# EAGLE board reveng-cpuonly-smdsock (EAGLE 6.4)
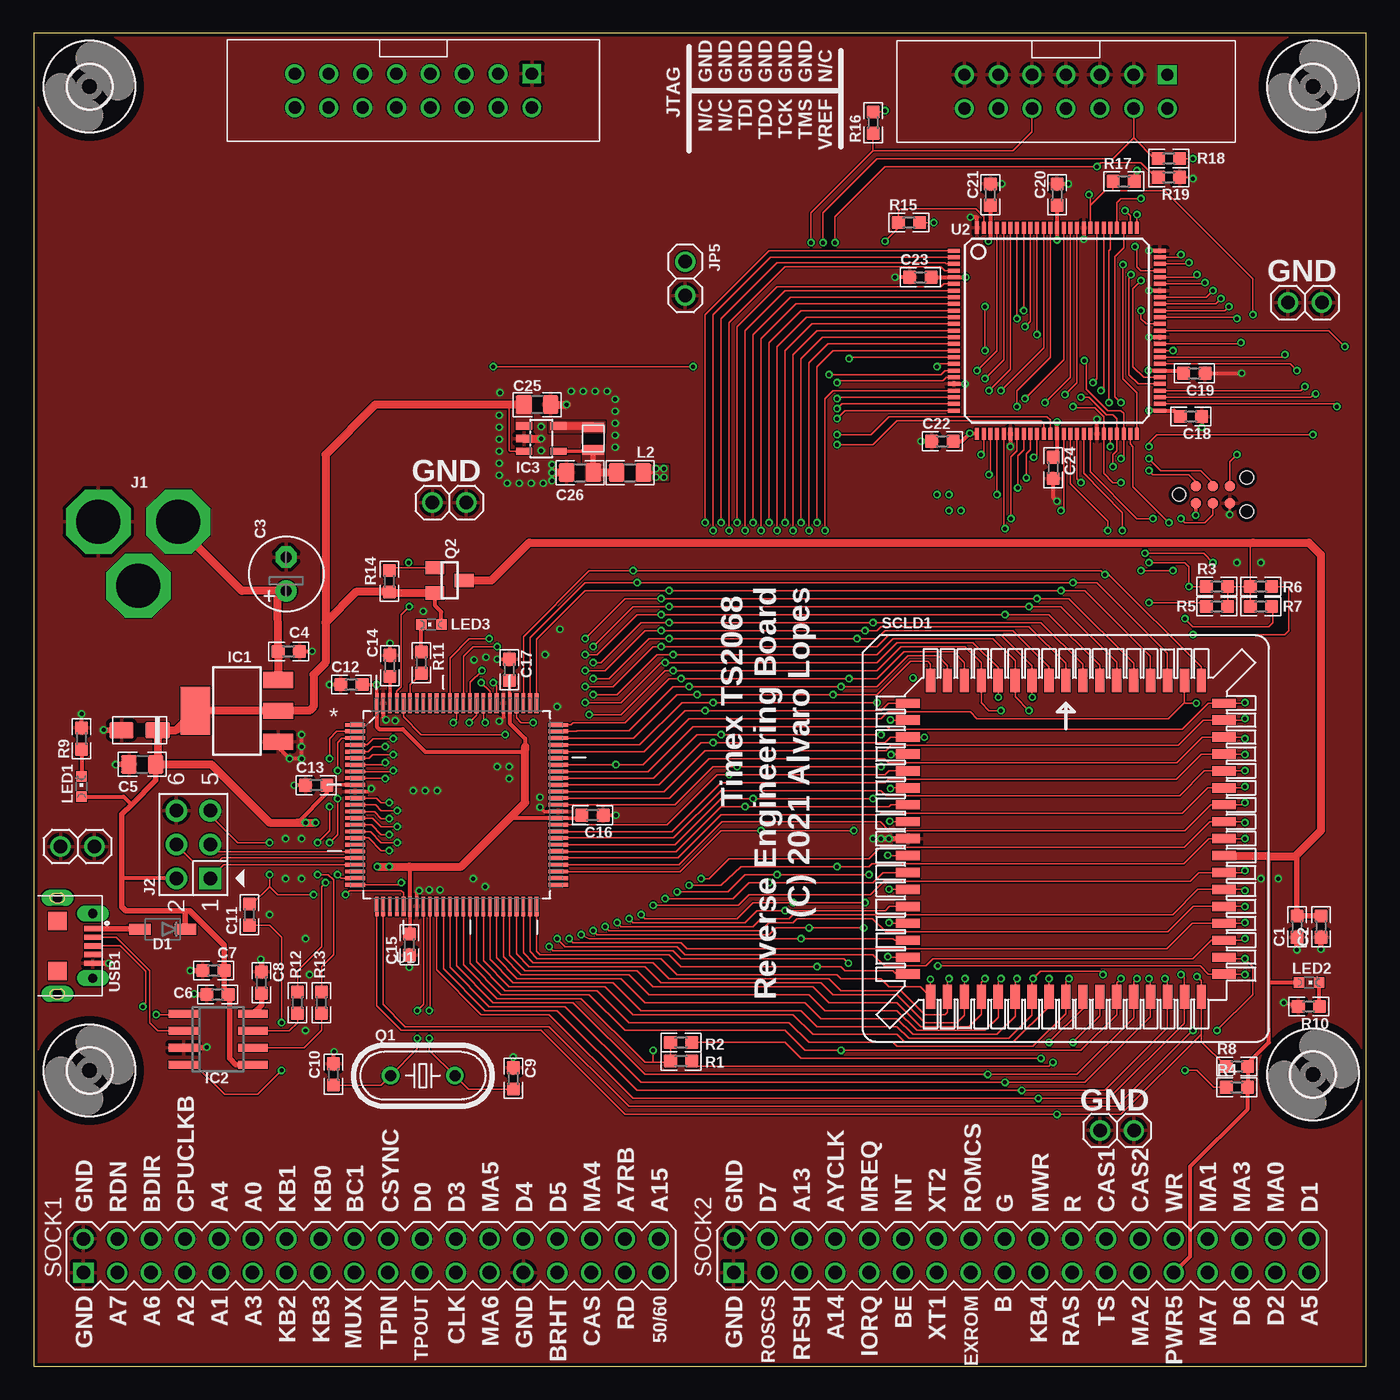
[diagram p2: board, top side]
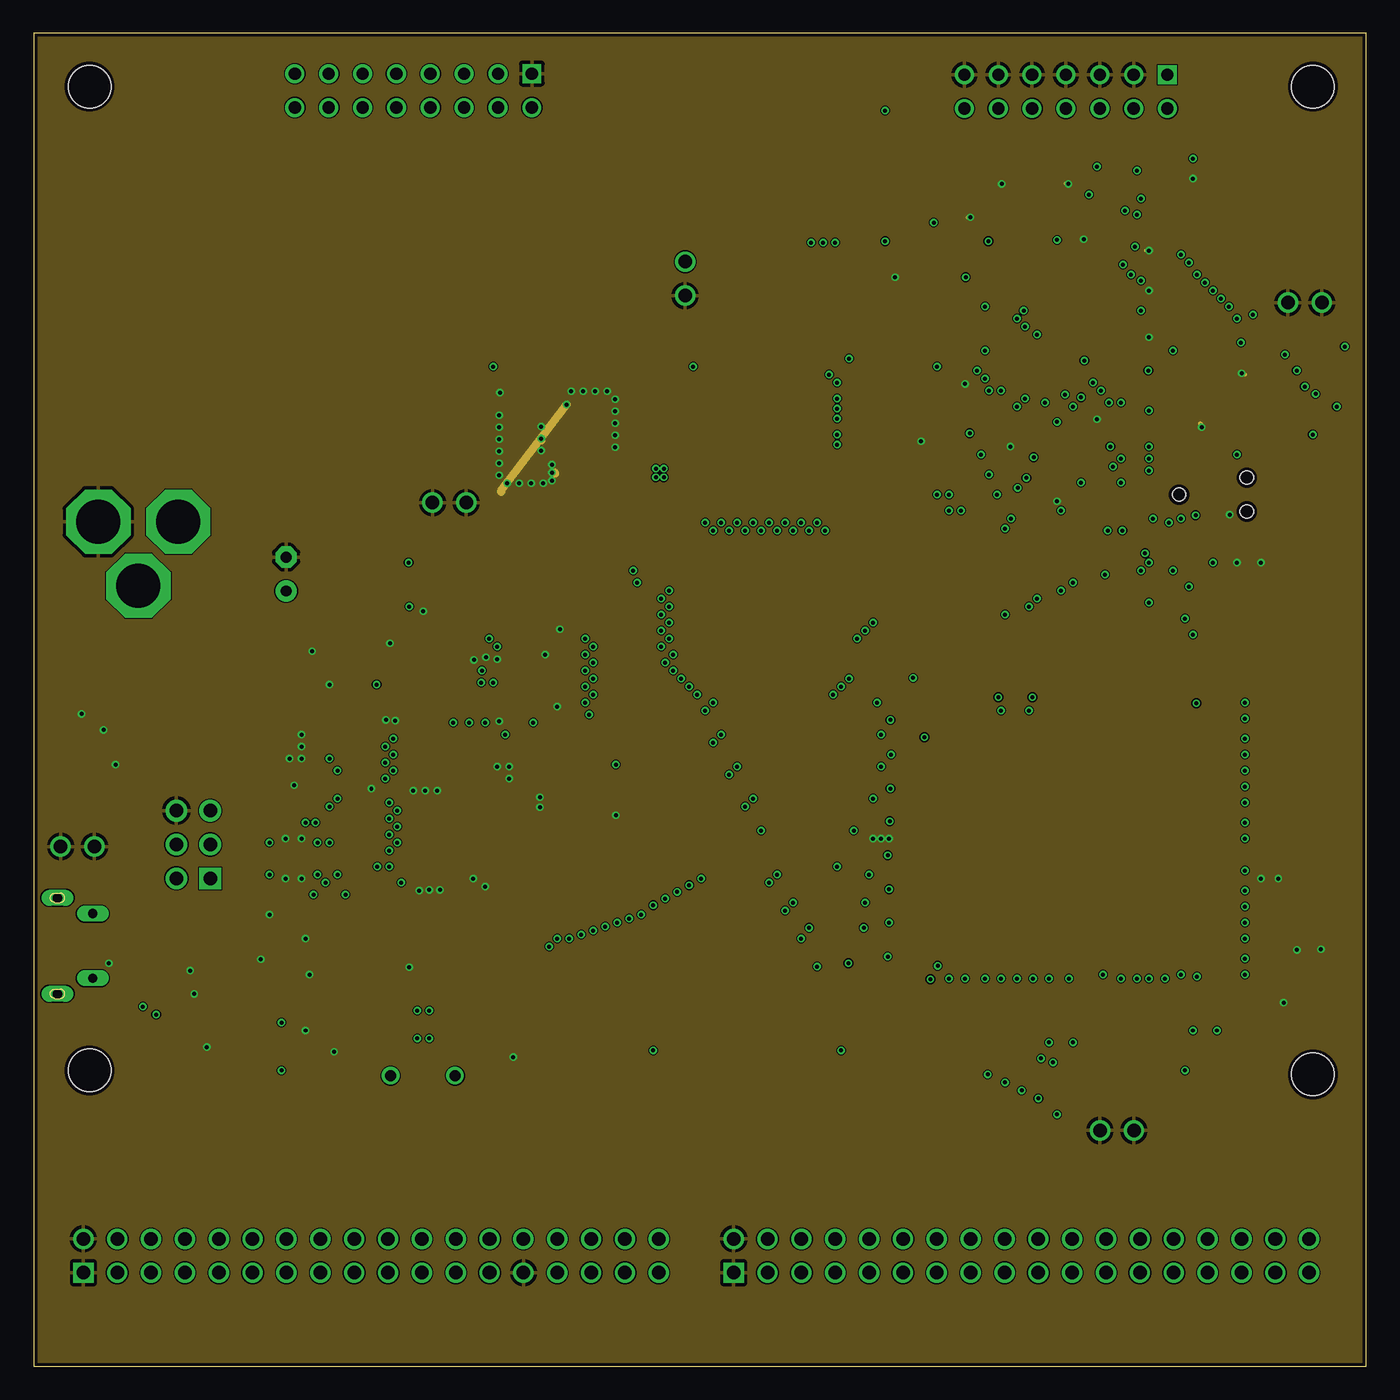
[diagram p3: board, inner layer Route2]
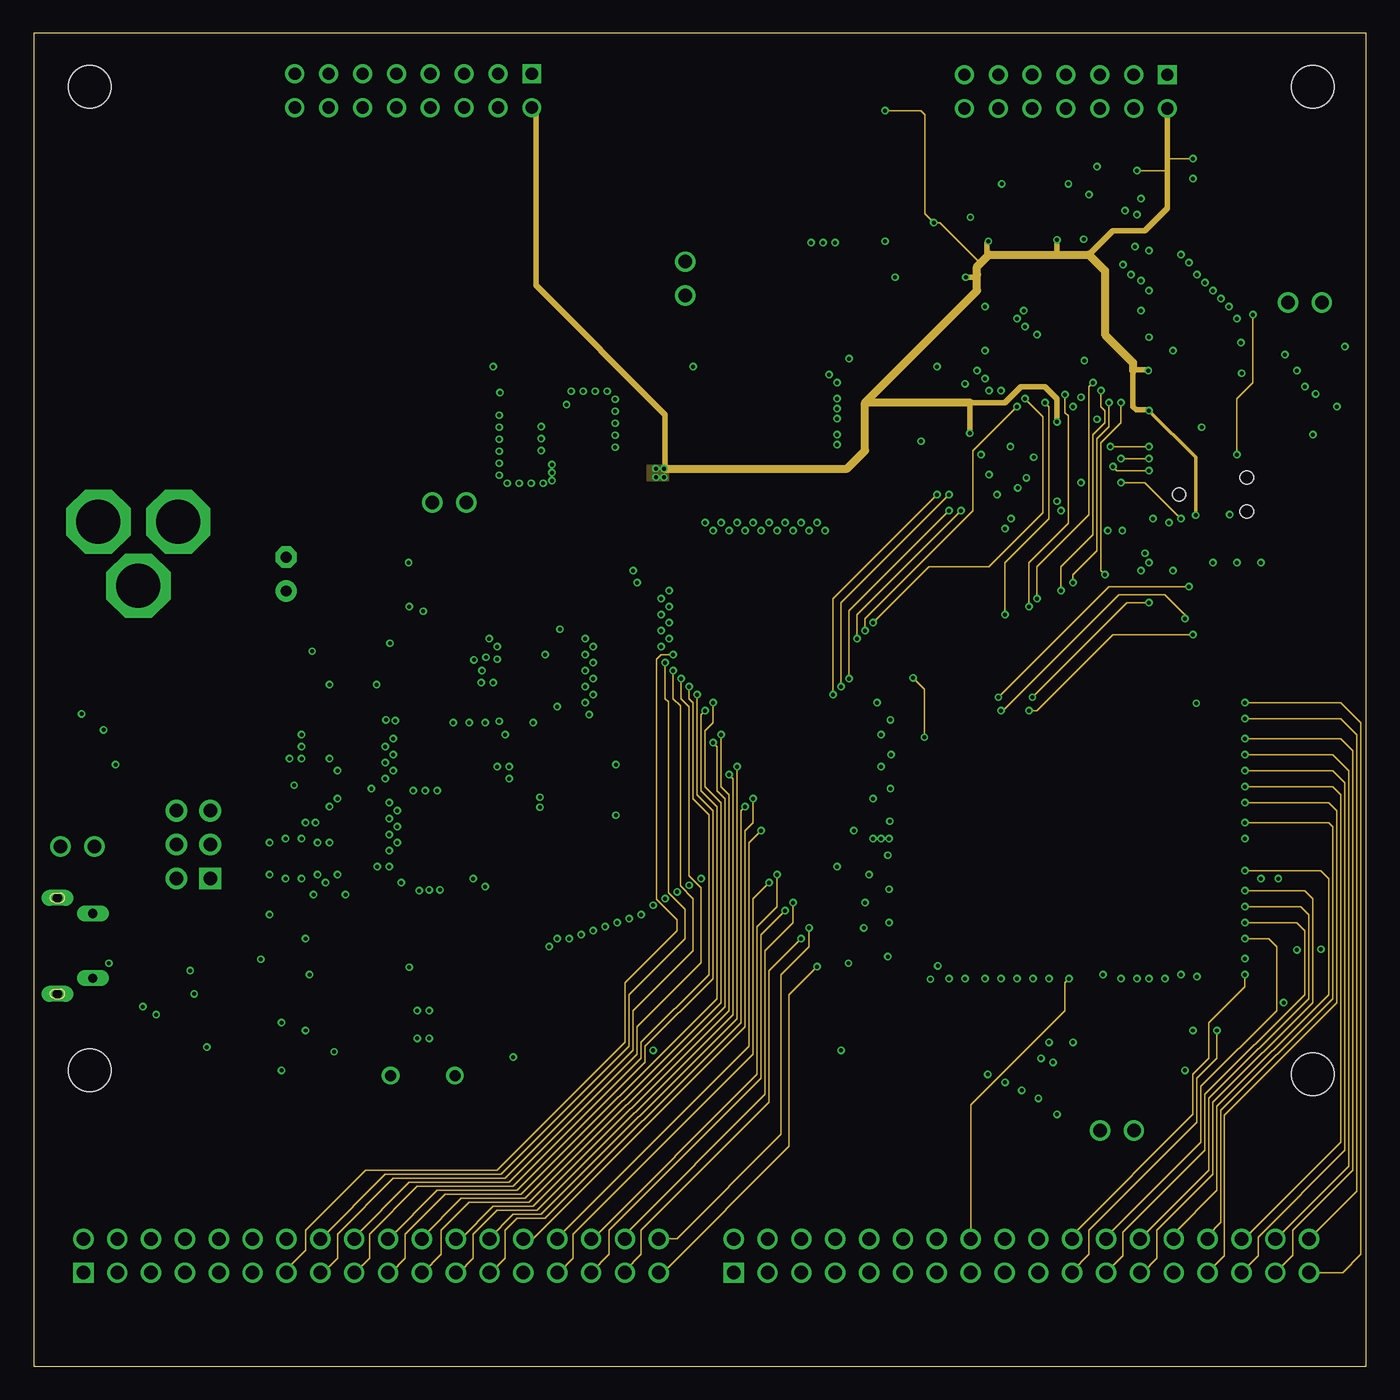
[diagram p4: board, inner layer Route15]
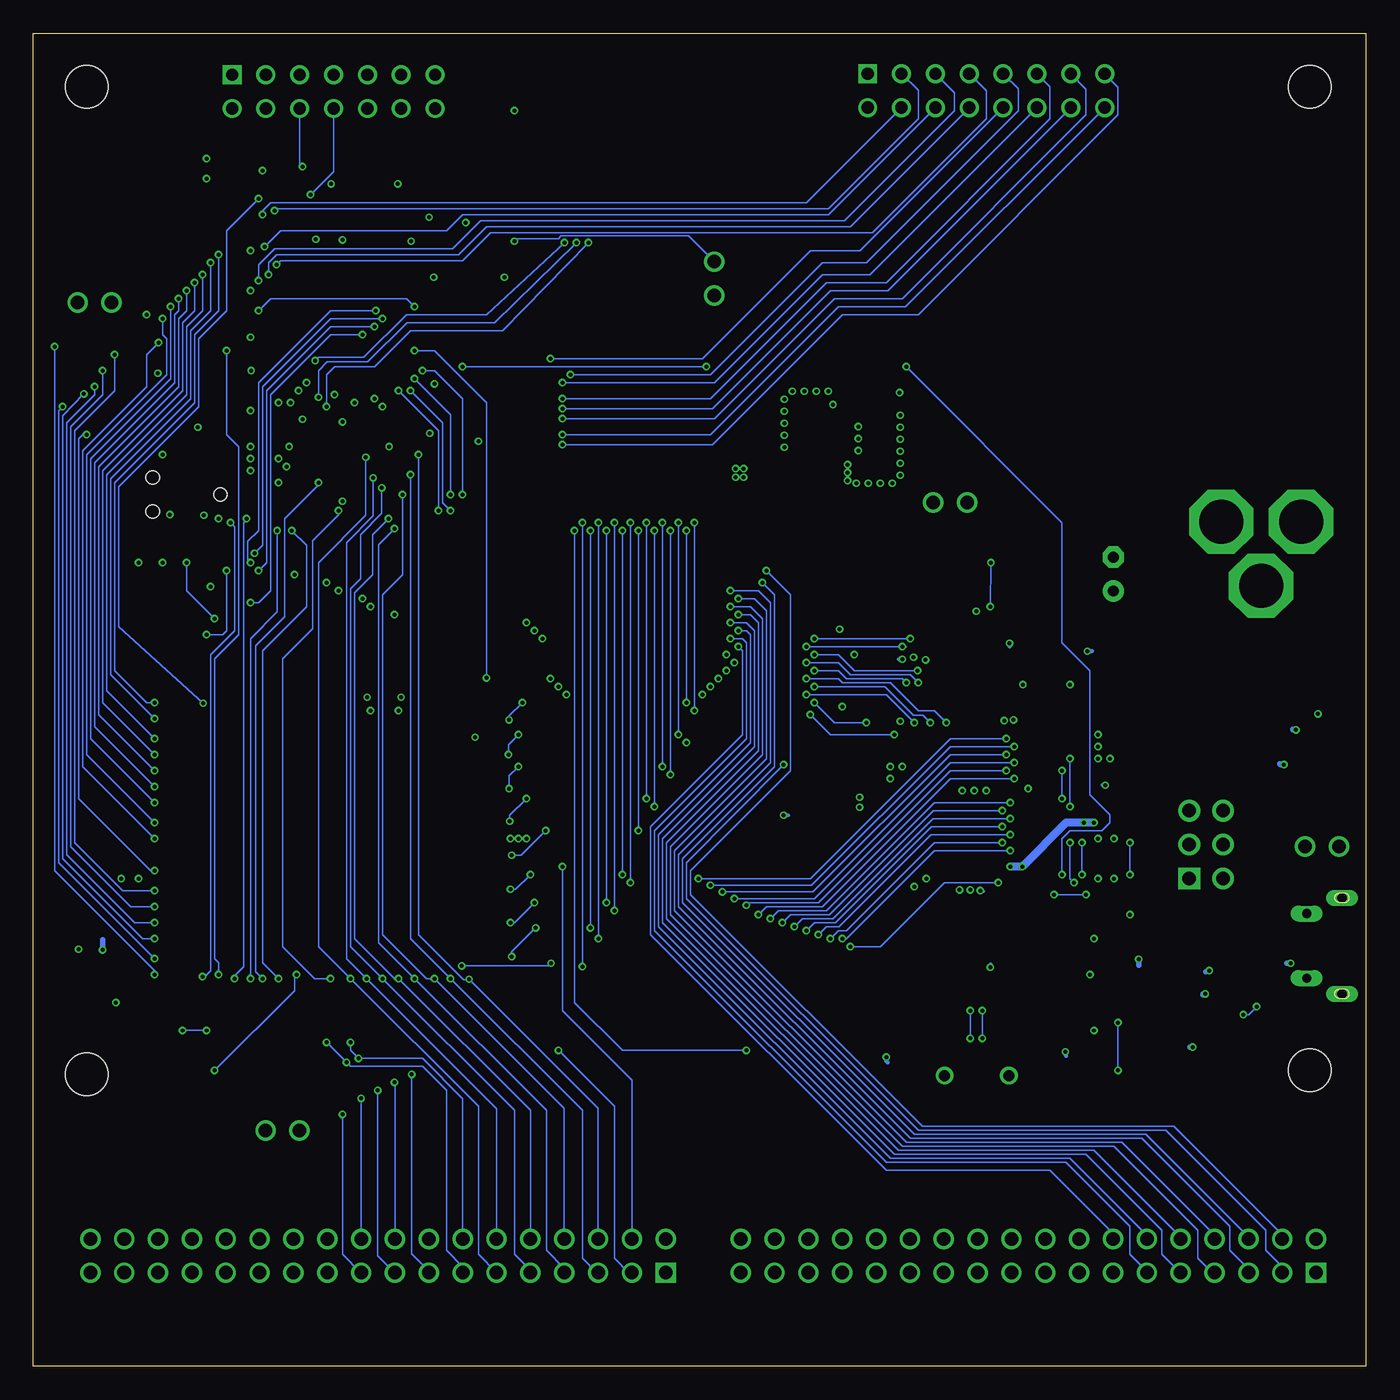
[diagram p5: board, bottom side, seen from below]

Size 100 x 100 mm. Coordinates in mm from the lower left corner, seen from the top.
Outline: 0,0 100,0 100,100 0,100 0,0
Copper layers (1*2*15*16): Top 0.035mm / dielectric 0.18mm / Route2 0.017mm / dielectric 1.12mm / Route15 0.017mm / dielectric 0.18mm / Bottom 0.035mm
Design rules "JLCPCB-FourLayerLayer *": minimum track width 3.5mil, minimum drill 0.2mm, track to track 3.5mil, track to pad 5mil, pad to pad 5mil, via to via 5mil, smd to smd 0mil, copper to edge 10mil, drill to drill 10mil, minimum pad ring 10mil, minimum via ring 0.125mm, stop-mask expansion 2mil, vias tented up to drill 100mil, thermal gap 10mil
tRestrict: area 41.1,69.2 to 43,70

## Footprints (pad centres in the part's own frame; a part is rotated, then mirrored left to right if it is on the bottom)
0603 = smd 1 x 1: 1 -0.8,0; 2 0.8,0
E2,5-6 = drill 0.813 pad 1.6: + -1.27,0 | drill 0.813 pad 1.6 octagon: - 1.27,0
0805 = smd 1.2 x 1.4: 1 -1,0; 2 1,0
TANT_CASE_A = smd 1.8 x 1.23: MINUS 1.355,0; PLUS -1.355,0
SOD-123 = smd 1.6 x 0.8: 1 -1.7,0; 2 1.7,0
SOT223 = smd 1.219 x 2.235: 1 -2.311,-3.099; 2 0,-3.099; 3 2.311,-3.099 | smd 3.6 x 2.2: 4 0,3.099
SOIC8 = smd 0.6 x 2.2: 1 -1.905,-2.6; 2 -0.635,-2.6; 3 0.635,-2.6; 4 1.905,-2.6; 5 1.905,2.6; 6 0.635,2.6; 7 -0.635,2.6; 8 -1.905,2.6
SOT23-5L = smd 0.55 x 1.2: 1 -0.95,-1.3; 2 0,-1.3; 3 0.95,-1.3; 4 0.95,1.3; 5 -0.95,1.3
SPC4078-NOSLOT = drill 3.302 pad 4.826 octagon: 1 -3,0; 2 0,-4.8; 3 3,0
HEADER_PRG_2X03 = drill 1.02 pad 1.632 square: 1 -2.54,-1.27 | drill 1.02 pad 1.632: 2 -2.54,1.27; 3 0,-1.27; 4 0,1.27; 5 2.54,-1.27; 6 2.54,1.27
1X02 = drill 1.016: 1 -1.27,0; 2 1.27,0
LED-603 = smd 0.8 x 0.8: A 0,-0.75; C 0,0.75
HC49U-V = drill 0.813: 1 -2.413,0; 2 2.413,0
SUPER-SOT3 = smd 1 x 1.4: 1 -0.95,-1.1; 2 0.95,-1.1; 3 0,1.1
PLCC68-AMP-SOCKET = smd 0.7 x 1.78: 1 0,11.865; 2 -1.27,11.865; 3 -2.54,11.865; 4 -3.81,11.865; 5 -5.08,11.865; 6 -6.35,11.865; 7 -7.62,11.865; 8 -8.89,11.865; 9 -10.16,11.865; 27 -10.16,-11.865; 28 -8.89,-11.865; 29 -7.62,-11.865; 30 -6.35,-11.865; 31 -5.08,-11.865; 32 -3.81,-11.865; 33 -2.54,-11.865; 34 -1.27,-11.865; 35 0,-11.865; 36 1.27,-11.865; 37 2.54,-11.865; 38 3.81,-11.865; 39 5.08,-11.865; 40 6.35,-11.865; 41 7.62,-11.865; 42 8.89,-11.865; 43 10.16,-11.865; 61 10.16,11.865; 62 8.89,11.865; 63 7.62,11.865; 64 6.35,11.865; 65 5.08,11.865; 66 3.81,11.865; 67 2.54,11.865; 68 1.27,11.865 | smd 1.78 x 0.7: 10 -11.865,10.16; 11 -11.865,8.89; 12 -11.865,7.62; 13 -11.865,6.35; 14 -11.865,5.08; 15 -11.865,3.81; 16 -11.865,2.54; 17 -11.865,1.27; 18 -11.865,0; 19 -11.865,-1.27; 20 -11.865,-2.54; 21 -11.865,-3.81; 22 -11.865,-5.08; 23 -11.865,-6.35; 24 -11.865,-7.62; 25 -11.865,-8.89; 26 -11.865,-10.16; 44 11.865,-10.16; 45 11.865,-8.89; 46 11.865,-7.62; 47 11.865,-6.35; 48 11.865,-5.08; 49 11.865,-3.81; 50 11.865,-2.54; 51 11.865,-1.27; 52 11.865,0; 53 11.865,1.27; 54 11.865,2.54; 55 11.865,3.81; 56 11.865,5.08; 57 11.865,6.35; 58 11.865,7.62; 59 11.865,8.89; 60 11.865,10.16
PIN-2X18 = drill 1.016 square: 1 -22.86,-1.27 | drill 1.016: 2 -22.86,1.27; 3 -20.32,-1.27; 4 -20.32,1.27; 5 -17.78,-1.27; 6 -17.78,1.27; 7 -15.24,-1.27; 8 -15.24,1.27; 9 -12.7,-1.27; 10 -12.7,1.27; 11 -10.16,-1.27; 12 -10.16,1.27; 13 -7.62,-1.27; 14 -7.62,1.27; 15 -5.08,-1.27; 16 -5.08,1.27; 17 -2.54,-1.27; 18 -2.54,1.27; 19 0,-1.27; 20 0,1.27; 21 2.54,-1.27; 22 2.54,1.27; 23 5.08,-1.27; 24 5.08,1.27; 25 7.62,-1.27; 26 7.62,1.27; 27 10.16,-1.27; 28 10.16,1.27; 29 12.7,-1.27; 30 12.7,1.27; 31 15.24,-1.27; 32 15.24,1.27; 33 17.78,-1.27; 34 17.78,1.27; 35 20.32,-1.27; 36 20.32,1.27
QFP50P1600X1600X120-100N = smd 1.473 x 0.279: 1 -7.62,5.994; 2 -7.62,5.512; 3 -7.62,5.004; 4 -7.62,4.496; 5 -7.62,3.988; 6 -7.62,3.505; 7 -7.62,2.997; 8 -7.62,2.489; 9 -7.62,2.007; 10 -7.62,1.499; 11 -7.62,0.991; 12 -7.62,0.508; 13 -7.62,0; 14 -7.62,-0.508; 15 -7.62,-0.991; 16 -7.62,-1.499; 17 -7.62,-2.007; 18 -7.62,-2.489; 19 -7.62,-2.997; 20 -7.62,-3.505; 21 -7.62,-3.988; 22 -7.62,-4.496; 23 -7.62,-5.004; 24 -7.62,-5.512; 25 -7.62,-5.994; 51 7.62,-5.994; 52 7.62,-5.512; 53 7.62,-5.004; 54 7.62,-4.496; 55 7.62,-3.988; 56 7.62,-3.505; 57 7.62,-2.997; 58 7.62,-2.489; 59 7.62,-2.007; 60 7.62,-1.499; 61 7.62,-0.991; 62 7.62,-0.508; 63 7.62,0; 64 7.62,0.508; 65 7.62,0.991; 66 7.62,1.499; 67 7.62,2.007; 68 7.62,2.489; 69 7.62,2.997; 70 7.62,3.505; 71 7.62,3.988; 72 7.62,4.496; 73 7.62,5.004; 74 7.62,5.512; 75 7.62,5.994 | smd 0.279 x 1.473: 26 -5.994,-7.62; 27 -5.512,-7.62; 28 -5.004,-7.62; 29 -4.496,-7.62; 30 -3.988,-7.62; 31 -3.505,-7.62; 32 -2.997,-7.62; 33 -2.489,-7.62; 34 -2.007,-7.62; 35 -1.499,-7.62; 36 -0.991,-7.62; 37 -0.508,-7.62; 38 0,-7.62; 39 0.508,-7.62; 40 0.991,-7.62; 41 1.499,-7.62; 42 2.007,-7.62; 43 2.489,-7.62; 44 2.997,-7.62; 45 3.505,-7.62; 46 3.988,-7.62; 47 4.496,-7.62; 48 5.004,-7.62; 49 5.512,-7.62; 50 5.994,-7.62; 76 5.994,7.62; 77 5.512,7.62; 78 5.004,7.62; 79 4.496,7.62; 80 3.988,7.62; 81 3.505,7.62; 82 2.997,7.62; 83 2.489,7.62; 84 2.007,7.62; 85 1.499,7.62; 86 0.991,7.62; 87 0.508,7.62; 88 0,7.62; 89 -0.508,7.62; 90 -0.991,7.62; 91 -1.499,7.62; 92 -2.007,7.62; 93 -2.489,7.62; 94 -2.997,7.62; 95 -3.505,7.62; 96 -3.988,7.62; 97 -4.496,7.62; 98 -5.004,7.62; 99 -5.512,7.62; 100 -5.994,7.62
LQFP100 = smd 0.9 x 0.3: 1 -7.72,6; 2 -7.72,5.5; 3 -7.72,5; 4 -7.72,4.5; 5 -7.72,4; 6 -7.72,3.5; 7 -7.72,3; 8 -7.72,2.5; 9 -7.72,2; 10 -7.72,1.5; 11 -7.72,1; 12 -7.72,0.5; 13 -7.72,0; 14 -7.72,-0.5; 15 -7.72,-1; 16 -7.72,-1.5; 17 -7.72,-2; 18 -7.72,-2.5; 19 -7.72,-3; 20 -7.72,-3.5; 21 -7.72,-4; 22 -7.72,-4.5; 23 -7.72,-5; 24 -7.72,-5.5; 25 -7.72,-6; 51 7.72,-6; 52 7.72,-5.5; 53 7.72,-5; 54 7.72,-4.5; 55 7.72,-4; 56 7.72,-3.5; 57 7.72,-3; 58 7.72,-2.5; 59 7.72,-2; 60 7.72,-1.5; 61 7.72,-1; 62 7.72,-0.5; 63 7.72,0; 64 7.72,0.5; 65 7.72,1; 66 7.72,1.5; 67 7.72,2; 68 7.72,2.5; 69 7.72,3; 70 7.72,3.5; 71 7.72,4; 72 7.72,4.5; 73 7.72,5; 74 7.72,5.5; 75 7.72,6 | smd 0.3 x 0.9: 26 -6,-7.72; 27 -5.5,-7.72; 28 -5,-7.72; 29 -4.5,-7.72; 30 -4,-7.72; 31 -3.5,-7.72; 32 -3,-7.72; 33 -2.5,-7.72; 34 -2,-7.72; 35 -1.5,-7.72; 36 -1,-7.72; 37 -0.5,-7.72; 38 0,-7.72; 39 0.5,-7.72; 40 1,-7.72; 41 1.5,-7.72; 42 2,-7.72; 43 2.5,-7.72; 44 3,-7.72; 45 3.5,-7.72; 46 4,-7.72; 47 4.5,-7.72; 48 5,-7.72; 49 5.5,-7.72; 50 6,-7.72; 76 6,7.72; 77 5.5,7.72; 78 5,7.72; 79 4.5,7.72; 80 4,7.72; 81 3.5,7.72; 82 3,7.72; 83 2.5,7.72; 84 2,7.72; 85 1.5,7.72; 86 1,7.72; 87 0.5,7.72; 88 0,7.72; 89 -0.5,7.72; 90 -1,7.72; 91 -1.5,7.72; 92 -2,7.72; 93 -2.5,7.72; 94 -3,7.72; 95 -3.5,7.72; 96 -4,7.72; 97 -4.5,7.72; 98 -5,7.72; 99 -5.5,7.72; 100 -6,7.72
IND_0806 = smd 0.7 x 1.6: P$1 -0.85,0; P$2 0.85,0
TC2030-IDC-NL = smd 0.787 x 0.787: 1 -1.27,-0.635; 2 -1.27,0.635; 3 0,-0.635; 4 0,0.635; 5 1.27,-0.635; 6 1.27,0.635 | hole 1: -2.54,0; 2.54,1.27; 2.54,-1.27
3,2 = hole 3.2: 0,0
RIBBON-CONN-2X7 = drill 0.914 square: 1 -8.89,0 | drill 0.914: 2 -8.89,2.54; 3 -6.35,0; 4 -6.35,2.54; 5 -3.81,0; 6 -3.81,2.54; 7 -1.27,0; 8 -1.27,2.54; 9 1.27,0; 10 1.27,2.54; 11 3.81,0; 12 3.81,2.54; 13 6.35,0; 14 6.35,2.54
RIBBON-CONN-2X8 = drill 0.914 square: 1 -8.89,-1.27 | drill 0.914: 2 -8.89,1.27; 3 -6.35,-1.27; 4 -6.35,1.27; 5 -3.81,-1.27; 6 -3.81,1.27; 7 -1.27,-1.27; 8 -1.27,1.27; 9 1.27,-1.27; 10 1.27,1.27; 11 3.81,-1.27; 12 3.81,1.27; 13 6.35,-1.27; 14 6.35,1.27; 15 8.89,-1.27; 16 8.89,1.27
MICROUSB_SMD_TH_7.5MM_4.85MM = smd 0.4 x 1.25: P1 1.3,-2.815; P2 0.65,-2.815; P3 0,-2.815; P4 -0.65,-2.815; P5 -1.3,-2.815 | smd 1.375 x 1.375: S1 -1.875,-0.175; S2 1.875,-0.175 | drill 0.7 pad 1.05 long: S3 -3.6,-0.175; S4 3.6,-0.175 | drill 0.7 pad 1 long: S5 -2.425,-2.825; S6 2.425,-2.825

## Placement (x,y rotation side)
C1  100nF 16V  [0603]  94.8,33 90 top
C2  100nF 16V  [0603]  96.6,33 90 top
C3  47uF 16V  [E2,5-6]  18.96,59.44 90 top
C4  100nF 16V  [0603]  19.15,53.64 180 top
C5  10uF 16V  [0805]  8.16,45.17 0 top
C6  1uF 16V  [0603]  13.8,27.9 0 top
C7  100nF 16V  [0603]  13.5,29.7 0 top
C8  100nF 16V  [0603]  17.1,28.8 270 top
C9  16pF 6.3V  [0603]  36,21.6 270 top
C10  16pF 6.3V  [0603]  22.5,21.9 270 top
C11  10uF 10V  [0603]  16.2,33.9 90 top
C12  100nF 16V  [0603]  23.85,51.15 0 top
C13  100nF 16V  [0603]  21.2,43.6 0 top
C14  100nF 16V  [0603]  26.75,52.55 270 top
C15  100nF 16V  [0603]  28.2,31.65 90 top
C16  100nF 16V  [0603]  41.95,41.35 180 top
C17  100nF 16V  [0603]  35.7,52.25 270 top
C18  100nF  [0603]  86.85,71.25 180 top
C19  100nF  [0603]  87.1,74.5 180 top
C20  100nF  [0603]  76.8,87.9 270 top
C21  100nF  [0603]  71.8,87.9 270 top
C22  100nF  [0603]  68.2,69.4 0 top
C23  100nF  [0603]  66.55,81.7 0 top
C24  100nF  [0603]  76.5,67.4 90 top
C25  4.7uF  [0805]  37.8,72.15 180 top
C26  10uF  [0805]  41,67.05 0 top
C99  47uF 10V TANT  [TANT_CASE_A]  7.96,47.73 180 top
D1  1N4148W  [SOD-123]  9.69,32.79 180 top
IC1  LM1117  [SOT223]  15.25,49.18 90 top
IC2  CH330N  [SOIC8]  13.86,24.55 270 top
IC3  LM3671MF  [SOT23-5L]  38.1,69.6 270 top
J1  [SPC4078-NOSLOT]  7.86,63.36 0 top
J2  CON_HEADER_PRG_AVR_ICSP-PTH  [HEADER_PRG_2X03]  11.99,39.15 90 top
JP1  [1X02]  95.4,79.8 0 top
JP2  [1X02]  81.3,17.7 0 top
JP3  [1X02]  31.2,64.8 0 top
JP4  [1X02]  3.3,39 0 top
JP5  [1X02]  48.9,81.6 270 top
L2  600R@100MHz 1A  [0805]  44.75,67.05 0 top
LED1  LED_RED_SMD  [LED-603]  3.6,43.5 0 top
LED2  LED_RED_SMD  [LED-603]  95.7,28.8 270 top
LED3  LED_GREEN_SMD  [LED-603]  29.85,55.65 90 top
Q1  16MHz  [HC49U-V]  29.21,21.81 0 top
Q2  FDN360P  [SUPER-SOT3]  31.21,58.96 270 top
R1  33R  [0603]  48.6,22.91 180 top
R2  33R  [0603]  48.6,24.3 180 top
R3  10K  [0603]  88.8,58.5 0 top
R4  10K  [0603]  90.3,20.94 0 top
R5  10K  [0603]  88.8,57 0 top
R6  10K  [0603]  92.1,58.5 180 top
R7  10K  [0603]  92.1,57 180 top
R8  10K  [0603]  90.3,22.5 0 top
R9  4K7  [0603]  3.6,47.1 90 top
R10  4K7  [0603]  95.7,27 180 top
R11  4K7  [0603]  29.1,52.8 270 top
R12  33R  [0603]  19.8,27.3 90 top
R13  33R  [0603]  21.6,27.3 90 top
R14  10K  [0603]  26.7,58.9 270 top
R15  4K7  [0603]  65.7,85.8 0 top
R16  10K/DNP  [0603]  63,93.3 90 top
R17  10K/DNP  [0603]  81.8,88.9 0 top
R18  10K/DNP  [0603]  85.2,90.6 0 top
R19  10K/DNP  [0603]  85.2,89.2 180 top
SCLD1  2048SCLDSMDSOCK  [PLCC68-AMP-SOCKET]  77.47,39.59 0 top
SOCK1  PIN-2X18  [PIN-2X18]  26.6,8.3 0 top
SOCK2  PIN-2X18  [PIN-2X18]  75.4,8.3 0 top
U1  ATMEGA2560-16AU  [QFP50P1600X1600X120-100N]  31.75,42.13 0 top
U2  XILINX_XC95144-10TQ100CLQFP  [LQFP100]  76.8,77.7 0 top
U$4  VLS201610HBX1R5-M1  [IND_0806]  42,69.6 270 top
U$5  TC2030-IDC-NL  [TC2030-IDC-NL]  88.5,65.4 0 top
U$6  [3,2]  4.2,22.2 0 top
U$7  [3,2]  96,21.9 0 top
U$8  RIBBON-CONN-2X7  [RIBBON-CONN-2X7]  76.2,96.9 180 top
U$9  RIBBON-CONN-2X8  [RIBBON-CONN-2X8]  28.5,95.7 180 top
U$10  [3,2]  4.2,96 0 top
U$11  [3,2]  96,96 0 top
USB1  CONN-MICROUSBP2  [MICROUSB_SMD_TH_7.5MM_4.85MM]  1.62,31.55 90 top

## Tracks (layer width: path | path; a pad name or v marks a point on that pad's centre or on a via)
50/60  (via drill 0.3)
  Top 0.128: SCLD1.26 64.77,29.37 64.8,29.4 64.5,29.7 60.9,29.7 60.6,30 v58.8,30 48.6,30 47.7,30.9 38,30.9 37.74,31.16 U1.50 | U2.16 60,76.2 58.8,75 v58.8,63.3
  Route15 0.128: SOCK1.35 47.23,7.03 56.7,16.5 56.7,27.9 v58.8,30
  Bottom 0.128: v58.8,63.3 v58.8,30
+3V3  (via drill 0.3)
  Top 0.128: R15.2 v67.55,85.8 | R16.2 63.8,94.1 v63.9,94.2 | R18.2 v87,90.6 | R17.2 82.6,89.5 v82.8,89.7
  Top 0.254: U$5.1 87.23,63.88 v87.2,63.85
  Top 0.305: v76.8,70.85 U2.38 76.8,68.6 C24.2 | U2.26 70.37,69.98 v70.25,70 69.65,69.4 C22.2 | v69.95,81.7 U2.5 C23.2 | v71.65,84.4 71.8,84.55 U2.98 C21.2 | v76.8,84.5 U2.88 C20.2 | C19.2 86.1,74.7 U2.57 v83.65,74.7 | C18.2 85.6,71.7 U2.51 v83.7,71.7 | L2.2 46.35,67.05
  Route15 0.128: 71.05,82.75 68,85.8 v67.55,85.8 66.9,86.45 66.9,93.9 66.6,94.2 v63.9,94.2 | v87,90.6 85.09,90.6 | v82.8,89.7 85.09,89.7
  Route15 0.254: v87.2,63.85 87.2,68.2 v83.7,71.7 | 47.4,67.45 v47.3,67.35
  Route15 0.305: v76.8,70.85 76.8,70.9 | v70.25,70 70.35,69.95 70.3,69.9 | v69.95,81.7 70.05,81.7 | v71.65,84.4 71.55,84.3 | v76.8,84.5 76.8,84.35 | v83.65,74.7 83.6,74.7 83.55,74.75 | v83.7,71.7 83.7,71.75
  Route15 0.406: v76.8,70.85 76.8,72.6 75.9,73.5 74.1,73.5 72.9,72.3 70.25,72.3 v70.25,70 | 83.55,74.75 82.55,74.75 82.5,74.7 82.5,72 82.75,71.75 83.7,71.75 | 70.05,81.7 70.6,81.7 70.8,81.9 | 71.55,84.3 71.55,83.55 71.7,83.4 | 76.8,84.35 76.8,83.4 | 47.4,67.45 47.4,71.4 37.69,81.11 37.69,94.13 U$9.2 | U$8.2 85.09,90.6 85.09,89.7 85.09,86.89 83.4,85.2 81,85.2 79.2,83.4
  Route15 0.61: v47.3,67.35 61.05,67.35 62.4,68.7 62.4,72.3 | 62.4,72.3 70.8,80.7 70.8,81.9 70.8,82.5 71.05,82.75 71.7,83.4 76.8,83.4 79.2,83.4 80.4,82.2 80.4,77.4 82.5,75.3 82.5,74.7 | 70.25,72.3 62.4,72.3
  other vias: 46.7,67.35 46.7,66.7 47.3,66.7
  pour Top (no thermals): 46.05,67.6 47.65,67.6 47.65,66.45 46.05,66.45
  pour Route15 (no thermals): 46.05,67.6 47.65,67.6 47.65,66.45 46.05,66.45
+5V  (via drill 0.3)
  Top 0.128: IC3.3 35.75,68.65 35.7,68.7 35.7,72.15
  Top 0.254: U1.100 v25.76,51.14 v25.75,51.15 C12.2 | U1.10 22.03,43.63 C13.2 | U1.31 28.25,32.49 C15.2 | U1.61 40.94,41.14 C16.2 | U1.80 35.74,51.41 C17.2
  Top 0.305: U1.61 35.74,41.14 35.55,40.95 | U1.80 35.74,48.26 36.9,47.1 36.9,46.5 | U1.100 25.76,47.99 25.95,47.8 27.7,47.8 29.4,46.1 36.7,46.1 36.9,46.3 | U1.31 28.25,37.45 28.2,37.5 | C13.2 22,43 19.8,40.8 | J2.2 6.62,36.61 6.61,36.6 | LED1.A 6.75,42.75 7.35,42.15 | LED3.A 30.6,56.6 30.15,57.05 30.15,57.97 Q2.2
  Top 0.406: C5.2 9.16,43.96 7.35,42.15 6.61,41.41 6.61,36.6 6.61,34.5 6.91,34.2 11.4,34.2 | IC2.5 15.15,22.64 14.7,23.1 14.7,27.8 C6.2 14.3,28.2 C7.2 14.3,31.6 11.7,34.2 11.4,34.2 | D1.1 11.39,34.19 11.4,34.2
  Top 0.61: v21.15,40.8 19.8,40.8 17.7,40.8 13.33,45.17 C5.2 9.31,45.33 C99.PLUS 10.7,47.73 IC1.4 IC1.2 18.37,49.2 20.7,49.2 21,49.5 21,51.9 21.9,52.8 21.9,55.8 | v25.8,37.5 28.2,37.5 32.1,37.5 35.55,40.95 36.9,42.3 36.9,46.3 36.9,46.5 | Q2.2 26.79,58.01 R14.2 24.2,58.1 21.9,55.8 | 21.9,55.8 21.9,68.4 25.65,72.15 35.7,72.15 C25.2
  Bottom 0.254: v25.75,51.15 25.65,51.15
  Bottom 0.61: v20.4,40.8 v21.15,40.8 22.5,40.8 v25.8,37.5 v26.7,37.5
  pour Top (no thermals): 37.4,70.3 37.4,72.8 36.2,72.8 36.2,70.3
+9V
  Top 0.61: IC1.3 C4.2 18.35,54.28 18.3,57.6 18.87,58.17 C3.+ 15.63,58.17 10.8,63 J1.3
A0  (via drill 0.3)
  Top 0.128: SCLD1.1 77.47,52.73 74.7,55.5 63.6,55.5 63.3,55.2 v62.4,55.2 v47.1,55.2 45.9,55.2 42.9,52.2 v41.4,52.2 | U1.82 34.75,51.05 v34.5,51.3 | U2.89 76.3,75.7 73.8,73.2 v73.8,72
  Route15 0.128: v62.4,55.2 62.4,56.1 70.5,64.2 70.5,68.7 v73.8,72
  Bottom 0.128: v41.4,52.2 39.6,52.2 39,51.6 34.8,51.6 v34.5,51.3 | SOCK1.12 16.44,9.84 22.2,15.6 35.7,15.6 53.1,33 53.1,39.9 46.2,46.8 46.2,54.6 46.2,54.9 46.5,55.2 v47.1,55.2
A1  (via drill 0.3)
  Top 0.128: U1.83 34.24,50.66 v33.6,51.3 | v42,52.8 42.6,52.8 45.6,55.8 v47.7,55.8 v63,55.8 75.6,55.8 78.74,52.66 SCLD1.68 | U2.87 77.3,75.5 v74.4,72.6
  Route15 0.128: v74.4,72.6 75.75,71.25 75.75,64.05 71.7,60 67.2,60 v63,55.8
  Bottom 0.128: v33.6,51.3 34.2,51.9 38.7,51.9 39.6,52.8 v42,52.8 | SOCK1.9 13.93,7.03 15.3,8.4 15.3,10.2 21,15.9 35.4,15.9 52.8,33.3 52.8,39.6 45.9,46.5 45.9,55.2 46.2,55.5 46.5,55.8 v47.7,55.8
A2  (via drill 0.3)
  Top 0.128: U1.87 32.26,53.26 33,54 v34.8,54 | v42,54 45,57 v47.7,57 v74.7,57 77.1,57 81.28,52.82 SCLD1.66 | U2.85 78.3,73.8 v77.4,72.9
  Route15 0.128: v77.4,72.9 77.4,71.55 77.65,71.3 77.65,63.25 74.7,60.3 v74.7,57
  Bottom 0.128: v42,54 v34.8,54 34.5,54 | SOCK1.7 11.53,7.03 12.6,8.1 12.6,10.2 18.9,16.5 34.8,16.5 52.2,33.9 52.2,39 45.3,45.9 45.3,56.1 45.9,56.7 46.2,57 v47.7,57
A3  (via drill 0.3)
  Top 0.128: U1.88 31.75,48.55 v31.5,48.3 | v42,51.6 43.2,51.6 46.2,54.6 v47.7,54.6 v61.8,54.6 63.3,54.6 63.9,55.2 73.5,55.2 76.2,52.5 SCLD1.2 | U2.90 75.8,76.4 v72.6,73.2
  Route15 0.128: v69.6,64.2 61.8,56.4 v61.8,54.6
  Bottom 0.128: v42,51.6 39.6,51.6 39.3,51.3 35.7,51.3 33.6,49.2 32.4,49.2 v31.5,48.3 | v72.6,73.2 69.6,70.2 v69.6,64.2 | SOCK1.11 16.44,7.14 17.7,8.4 17.7,10.5 22.5,15.3 36,15.3 53.4,32.7 53.4,40.2 46.5,47.1 46.5,54 46.5,54.3 46.8,54.6 47.1,54.6 v47.7,54.6
A4  (via drill 0.3)
  Top 0.128: SCLD1.67 80.01,52.59 76.2,56.4 v72.9,56.4 v47.1,56.4 45.3,56.4 42.3,53.4 v41.4,53.4 | U1.86 32.74,51.31 v33.65,52.2 | U2.86 77.8,74.2 v75.9,72.3
  Route15 0.128: v75.9,72.3 76.2,72 76.2,63.6 72.9,60.3 v72.9,56.4
  Bottom 0.128: v33.65,52.2 38.4,52.2 39.6,53.4 v41.4,53.4 | SOCK1.10 13.9,9.7 20.4,16.2 35.1,16.2 52.5,33.6 52.5,39.3 45.6,46.2 45.6,55.8 45.9,56.1 46.2,56.4 v47.1,56.4
A5  (via drill 0.3)
  Top 0.128: SCLD1.60 90.15,49.75 | U1.68 46.12,44.62 49.5,48 64.05,48 64.25,47.8 86.2,47.8 88.15,49.75 SCLD1.60 | 85.8,83.4 v86.1,83.4 85.9,83.2 U2.74 | SCLD1.60 90.85,49.75 v90.9,49.8
  Route15 0.128: v90.9,49.8 98.1,49.8 99.6,48.3 99.6,8.4 98.23,7.03 SOCK2.35
  Bottom 0.128: v86.1,83.4 86.1,79.2 87.9,77.4 87.9,72.3 93.9,66.3 93.9,52.2 91.5,49.8 v90.9,49.8
A6  (via drill 0.3)
  Top 0.128: U1.76 37.74,54.54 41.4,58.2 v47.7,58.2 v77.1,58.2 78.9,58.2 83.82,53.28 SCLD1.64 | U2.81 80.3,73.4 v80.1,73.2
  Route15 0.128: v80.1,73.2 80.1,72 80.4,71.7 80.4,70.8 79.5,69.9 79.5,62.4 77.1,60 v77.1,58.2
  Bottom 0.128: SOCK1.5 8.82,7.32 10.2,8.7 10.2,10.5 16.8,17.1 34.2,17.1 51.6,34.5 51.6,38.4 44.7,45.3 44.7,57.3 45.6,58.2 v47.7,58.2
A7  (via drill 0.3)
  Top 0.128: U1.69 43.15,45.13 | 43.15,45.13 45.73,45.13 49.2,48.6 63.6,48.6 64.1,49.1 70.3,49.1 70.8,48.6 85.16,48.6 86.36,49.8 | v83.1,87.6 81.6,87.6 81.3,87.3 U2.79 | SCLD1.62 86.36,49.8 | v87.25,49.75 86.41,49.75 86.36,49.8 | 43.15,45.13 v43.7,45.15
  Bottom 0.128: v87.25,49.75 93.6,55.5 93.6,66 87.6,72 87.6,77.1 85.5,79.2 85.5,85.2 v83.1,87.6 | SOCK1.3 6.28,7.48 7.5,8.7 7.5,10.2 15,17.7 33.6,17.7 51,35.1 51,37.8 v43.7,45.15
A7RB  (via drill 0.3)
  Top 0.128: U1.9 26.36,44.14 v26.4,44.1 | v45.6,33.9 45.9,33.6 52.8,33.6 54,34.8 v57,34.8 v62.4,34.8 | U2.13 58.8,77.7 57,75.9 v57,62.7 | SCLD1.23 64.26,33.24 v64.2,33.3
  Route15 0.128: SOCK1.34 44.38,9.88 54.9,20.4 54.9,31.2 57,33.3 v57,34.8
  Bottom 0.128: v26.4,44.1 31.2,44.1 40.8,34.5 45,34.5 v45.6,33.9 | v57,62.7 v57,34.8 | v64.2,33.3 63.9,33.3 v62.4,34.8
A13  (via drill 0.3)
  Top 0.128: SCLD1.27 67.29,26.89 67.2,27 67.2,27.6 | U1.49 37.26,31.14 37.8,30.6 47.1,30.6 48.3,29.4 60.3,29.4 60.6,29.1 63.6,29.1 64.2,28.5 66.53,28.5 SCLD1.27 | U2.27 71.3,68.6 v71.1,68.4 | v67.3,29.05 SCLD1.27
  Bottom 0.128: v71.1,68.4 71.1,32.4 67.7,29 67.35,29 v67.3,29.05 57.62,19.37 SOCK2.6
A14  (via drill 0.3)
  Top 0.128: U1.46 35.74,30.86 36.9,29.7 45.3,29.7 46.5,28.5 58.5,28.5 59.7,27.3 64.8,27.3 66.6,25.5 70.2,25.5 71.12,26.42 SCLD1.30 71.12,28.82 v71.4,29.1 | U2.30 72.8,63.1 v72.9,62.85
  Bottom 0.128: v72.9,62.85 74.1,61.65 74.1,31.8 v71.4,29.1 61.5,19.2 61.5,8.7 60.16,7.36 SOCK2.7
A15  (via drill 0.3)
  Top 0.128: v62.3,32.9 v58.2,32.9 55.7,32.9 55.2,32.4 42.3,32.4 v42,32.7 | U1.15 25.46,41.14 26.1,40.5 v27.3,40.5 | U2.15 59.6,76.7 58.2,75.3 v58.2,62.7 | SCLD1.25 64.15,30.7 v64.1,30.75
  Route15 0.128: SOCK1.36 48.27,9.57 56.1,17.4 56.1,29.4 58.2,31.5 v58.2,32.9
  Bottom 0.128: v42,32.7 41.4,33.3 39.8,33.3 32.6,40.5 v27.3,40.5 | v58.2,62.7 v58.2,32.9 | v64.1,30.75 64.1,31.1 v62.3,32.9
AREF
  Top 0.254: U1.98 C14.2
AYCLK  (via drill 0.3)
  Top 0.128: 72.3,68.7 v72.3,65.4 U2.29 | U1.47 36.25,30.95 37.2,30 45.9,30 47.1,28.8 59.1,28.8 60,27.9 64.8,27.9 66.9,25.8 69.3,25.8 69.85,26.35 SCLD1.29 69.85,29.05 v69.9,29.1
  Bottom 0.128: v72.3,65.4 72.3,59.4 73.8,57.9 73.8,32.4 70.5,29.1 v69.9,29.1 60.16,19.36 SOCK2.8
B  (via drill 0.3)
  Top 0.128: U2.43 79.3,67.1 82.8,63.6 v84,63.6 | U1.36 30.76,29.84 33.9,26.7 39.3,26.7 45.3,20.7 v74.15,20.7 80.4,20.7 85.09,25.39 SCLD1.41 85.09,28.91 v84.9,29.1
  Bottom 0.128: v84,63.6 84.2,63.3 84.2,30 84.9,29.3 v84.9,29.1 | SOCK2.17 72.88,7.03 74.15,8.3 v74.15,20.7
BC1  (via drill 0.3)
  Top 0.128: SCLD1.7 69.85,52.8 69.05,53.6 65.3,53.6 63.3,51.6 v61.2,51.6 v48.6,51.6 47.7,51.6 44.4,48.3 40.5,48.3 40.32,48.12 U1.75 | U2.95 73.3,74.8 v71.7,73.2
  Route15 0.128: v68.7,64.2 61.2,56.7 v61.2,51.6 | SOCK1.18 24.06,9.66 28.2,13.8 35.7,13.8 45.3,23.4 45.3,25.5 50.1,30.3 50.1,35.9 49.2,36.8 49.2,49.5 48.6,50.1 v48.6,51.6
  Bottom 0.128: v68.7,64.2 69.3,64.8 69.3,70.8 v71.7,73.2
BDIR  (via drill 0.3)
  Top 0.128: SCLD1.63 85.09,53.51 79.8,58.8 v78,58.8 v45.3,58.8 41.4,58.8 37.26,54.66 U1.77 | v80.7,72.3 80.7,83.7 80.8,83.8 U2.80
  Route15 0.128: v78,58.8 78,59.4 79.8,61.2 79.8,69.6 80.7,70.5 v80.7,72.3
  Bottom 0.128: SOCK1.6 8.82,9.72 16.5,17.4 33.9,17.4 51.3,34.8 51.3,38.1 44.4,45 44.4,57.9 v45.3,58.8
BE  (via drill 0.3)
  Top 0.128: U1.42 33.76,30.44 35.7,28.5 42.9,28.5 45,26.4 57,26.4 58.5,24.9 64.8,24.9 65.4,24.3 73.5,24.3 76.2,27 SCLD1.34 v76.2,29.1 | U2.35 75.3,68.35 v75.05,68.2
  Bottom 0.128: v75.05,68.2 75.05,63.85 78.6,60.3 78.6,31.5 v76.2,29.1 66.6,19.5 66.6,8.4 SOCK2.11
BRIGHT  (via drill 0.3)
  Top 0.128: SCLD1.20 63.75,37.05 63,36.3 v55.2,36.3 53.7,36.3 52.5,35.1 v47.4,35.1 | U1.7 26.23,45.13 v26.4,45.3 | U2.10 57.6,79.2 55.2,76.8 v55.2,63.3
  Route15 0.128: SOCK1.29 39.43,7.03 40.5,8.1 40.5,9.9 54,23.4 54,35.1 v55.2,36.3
  Bottom 0.128: v26.4,45.3 31.2,45.3 41.4,35.1 v47.4,35.1 | v55.2,63.3 v55.2,36.3
CAS  (via drill 0.3)
  Top 0.128: U1.12 25.76,42.64 26.1,42.3 v26.7,42.3 | v44.7,33.6 45,33.3 53.4,33.3 54.3,34.2 v56.4,34.2 63.91,34.2 64.2,34.5 64.21,34.51 SCLD1.22 | U2.12 58.4,78.2 56.4,76.2 v56.4,63.3
  Route15 0.128: SOCK1.31 43.2,8.4 43.2,10.2 54.6,21.6 54.6,32.4 v56.4,34.2
  Bottom 0.128: v44.7,33.6 44.1,34.2 40.5,34.2 32.4,42.3 v26.7,42.3 | v56.4,63.3 v56.4,34.2
CAS1  (via drill 0.3)
  Top 0.128: U1.18 25.16,39.64 26.1,38.7 v26.7,38.7 | v39.3,32.1 39.9,31.5 48.3,31.5 48.9,30.9 63,30.9 63.85,30.05 66.95,30.05 67.5,30.6 87,30.6 88.37,31.97 SCLD1.46 90.77,31.97 v90.9,32.1 | U2.53 95.8,72.7 v96.2,72.95
  Route15 0.128: SOCK2.24 80.67,9.87 87.6,16.8 87.6,21 93.3,26.7 93.3,31.5 92.7,32.1 v90.9,32.1
  Bottom 0.128: v26.7,38.7 32.4,38.7 39,32.1 v39.3,32.1 | v96.2,72.95 97.8,71.3 97.8,38.1 91.8,32.1 v90.9,32.1
CAS2  (via drill 0.3)
  Top 0.128: U2.58 94.3,75.2 v94.8,74.7 | v90.9,34.5 v90.89,34.51 SCLD1.48 87.01,34.51 85.1,32.6 63.95,32.6 62.95,33.6 57.3,33.6 57,33.3 55.2,33.3 54.6,32.7 43.2,32.7 v42.9,33 | v26.7,41.1 26.1,41.1 25.58,41.62 U1.14
  Route15 0.128: SOCK2.26 83.07,9.57 88.2,14.7 88.2,20.1 95.7,27.6 95.7,33.9 95.1,34.5 v90.9,34.5
  Bottom 0.128: v94.8,74.7 94.8,72.9 97.2,70.5 97.2,39 92.7,34.5 v90.9,34.5 | v26.7,41.1 32.5,41.1 40,33.6 42.3,33.6 v42.9,33
CLK  (via drill 0.3)
  Top 0.128: SCLD1.14 64.17,44.67 63.9,44.4 v52.2,44.4 51.3,44.4 47.53,40.63 U1.60 | U2.4 68.4,82.2 68.1,82.5 56.4,82.5 52.2,78.3 v52.2,62.7
  Route15 0.128: SOCK1.23 31.93,7.03 33,8.1 33,9.9 34.8,11.7 37.8,11.7 52.5,26.4 52.5,44.1 v52.2,44.4
  Bottom 0.128: v52.2,62.7 v52.2,44.4
CPUCLKB  (via drill 0.3)
  Top 0.128: SCLD1.65 82.55,52.75 77.7,57.6 v75.3,57.6 v47.1,57.6 44.4,57.6 v41.4,54.6 | U1.89 31.24,53.14 32.7,54.6 v34.2,54.6 | U2.82 79.8,74.1 v79.5,73.8
  Route15 0.128: v79.5,73.8 79.2,73.5 79.2,63.9 75.3,60 v75.3,57.6
  Bottom 0.128: v41.4,54.6 v34.2,54.6 | SOCK1.8 11.36,9.86 18.3,16.8 34.5,16.8 51.9,34.2 51.9,38.7 45,45.6 45,56.7 45.9,57.6 v47.1,57.6
CSYNC  (via drill 0.3)
  Top 0.128: U1.73 45.03,47.13 48.3,50.4 v49.8,50.4 v60,50.4 63.3,50.4 65.79,52.89 67.11,52.89 67.31,52.69 SCLD1.9 | U2.97 72.3,76.2 v70.8,74.7
  Route15 0.128: v67.8,65.4 60,57.6 v60,50.4 | SOCK1.20 26.67,9.57 30.3,13.2 36.3,13.2 45.9,22.8 45.9,24 51,29.1 51,41.7 49.8,42.9 v49.8,50.4
  Bottom 0.128: v67.8,65.4 67.8,72.6 69.9,74.7 v70.8,74.7
D0  (via drill 0.3)
  Top 0.128: U1.72 45.47,46.63 48.65,49.8 v51,49.8 v63.3,49.8 | U2.2 55.3,83.2 51,78.9 v51,62.7 | SCLD1.11 64.32,48.48 v64.3,48.5
  Route15 0.128: SOCK1.22 29.14,9.64 32.1,12.6 36.9,12.6 51.6,27.3 51.6,42.3 50.4,43.5 50.4,47.7 51,48.3 v51,49.8
  Bottom 0.128: v51,62.7 v51,49.8 | v64.3,48.5 64.3,48.8 v63.3,49.8
D1  (via drill 0.3)
  Top 0.128: U2.73 86.6,82.7 v86.7,82.8 | v90.9,48.6 90.78,48.48 SCLD1.59 87.78,48.48 85.9,46.6 64.35,46.6 63.95,46.2 50.4,46.2 47.32,43.12 U1.65
  Route15 0.128: v90.9,48.6 98.1,48.6 99.3,47.4 99.3,13.15 SOCK2.36
  Bottom 0.128: v86.7,82.8 86.7,79.2 88.2,77.7 88.2,72.6 94.2,66.6 94.2,51.9 v90.9,48.6
D2  (via drill 0.3)
  Top 0.128: SCLD1.58 90.17,47.23 | U2.71 87.1,81.7 v87.3,81.9 | SCLD1.58 90.79,47.21 v90.9,47.1 | U1.64 47.74,42.64 50.7,45.6 63.85,45.6 64.15,45.3 85.8,45.3 87.71,47.21 SCLD1.58
  Route15 0.128: v90.9,47.1 98.1,47.1 99,46.2 99,14.7 94.5,10.2 94.5,8.35 SOCK2.33
  Bottom 0.128: v87.3,81.9 87.3,79.2 88.5,78 88.5,72.9 94.5,66.9 94.5,50.7 v90.9,47.1
D3  (via drill 0.3)
  Top 0.128: U1.67 46.54,44.14 49.8,47.4 v51.6,47.4 v63.6,47.4 | U2.3 68.5,82.7 68.4,82.8 55.8,82.8 51.6,78.6 v51.6,63.3 | SCLD1.13 64.39,45.94 v64.35,45.9
  Route15 0.128: SOCK1.24 32.07,9.57 34.5,12 37.5,12 52.2,26.7 52.2,42.9 51.6,43.5 v51.6,47.4
  Bottom 0.128: v51.6,63.3 v51.6,47.4 | v64.35,45.9 64.35,46.65 v63.6,47.4
D4  (via drill 0.3)
  Top 0.128: v63,42.6 v54,42.6 51.6,42.6 48.13,39.13 U1.57 | U2.8 56.8,80.2 54,77.4 v54,63.3 | SCLD1.17 64.29,40.86 v64.25,40.9
  Route15 0.128: SOCK1.28 37.47,9.57 53.4,25.5 53.4,40.2 54,40.8 v54,42.6
  Bottom 0.128: v54,63.3 v54,42.6 | v64.25,40.9 64.25,41.35 v63,42.6
D5  (via drill 0.3)
  Top 0.128: v61.55,40.2 v54.6,40.2 51.6,40.2 48.53,37.13 U1.53 | U2.9 57.2,79.7 54.6,77.1 v54.6,62.7 | SCLD1.19 64.13,38.32 v64.1,38.35
  Route15 0.128: SOCK1.30 39.3,9.6 53.7,24 53.7,39.3 v54.6,40.2
  Bottom 0.128: v54.6,62.7 v54.6,40.2 | v64.1,38.35 63.4,38.35 v61.55,40.2
D6  (via drill 0.3)
  Top 0.128: SCLD1.56 90.03,44.67 | U2.68 88,80.2 v88.5,80.7 | SCLD1.56 90.87,44.67 v90.9,44.7 | U1.58 48.04,39.64 51.6,43.2 63.6,43.2 64,42.8 86,42.8 87.87,44.67 SCLD1.56
  Route15 0.128: SOCK2.31 91.9,8.3 91.9,9.7 98.4,16.2 98.4,43.8 97.5,44.7 v90.9,44.7
  Bottom 0.128: v88.5,80.7 88.5,79.2 89.1,78.6 89.1,73.5 95.1,67.5 95.1,48.9 v90.9,44.7
D7  (via drill 0.3)
  Top 0.128: SCLD1.52 90.17,39.73 | U2.61 90.5,76.7 v90.6,76.8 | SCLD1.52 v90.89,39.59 v90.9,39.6 | v49.2,36.1 51.6,36.1 53.1,37.5 v60.3,37.5 62.7,37.5 62.9,37.7 86.3,37.7 88.19,39.59 SCLD1.52 | U1.5 25.12,46.12 25.5,46.5 v26.4,46.5
  Bottom 0.128: v90.6,76.8 91.5,75.9 91.5,73.5 96.3,68.7 96.3,45 v90.9,39.6 | v49.2,36.1 41.6,36.1 31.2,46.5 v26.4,46.5 | SOCK2.4 55.08,21.48 60.3,26.7 v60.3,37.5
DM
  Top 0.128: USB1.P2 6.2,32.2 8.7,29.7 8.7,25.8 9.31,25.18 IC2.2
DP  (via drill 0.3)
  Top 0.128: USB1.P3 6.5,31.55 8.4,29.65 8.4,27.3 8.2,27.1 v8.2,27 | v9.2,26.4 11.21,26.4 IC2.1
  Bottom 0.128: v9.2,26.4 8.8,26.4 v8.2,27
EXROM  (via drill 0.3)
  Top 0.128: U2.41 78.3,66.6 v78.6,66.3 | U1.38 31.75,30.05 34.5,27.3 40.5,27.3 45.9,21.9 v71.6,21.9 78.3,21.9 82.55,26.15 SCLD1.39 82.55,28.85 v82.8,29.1
  Bottom 0.128: v82.8,29.1 83.3,29.6 83.3,54.05 81.3,56.1 81.15,56.25 81.15,63.6 78.6,66.15 v78.6,66.3 | SOCK2.15 70.32,7.17 71.6,8.45 v71.6,21.9
EXT0  (via drill 0.3)
  Top 0.128: U2.17 61.3,75.7 v61.2,75.6
  Bottom 0.128: v61.2,75.6 49.8,75.6 41.7,83.7 37.96,83.7 U$9.10
EXT1  (via drill 0.3)
  Top 0.128: U2.19 68.4,74.7 68.1,74.4 v59.7,74.4
  Bottom 0.128: v59.7,74.4 49.2,74.4 40.8,82.8 37.5,82.8 26.1,94.2 26.1,95.84 U$9.9
EXT2  (via drill 0.3)
  Top 0.128: U2.20 68.5,74.2 68.25,73.95 60.45,73.95 v60.3,73.8
  Bottom 0.128: v60.3,73.8 48.9,73.8 40.8,81.9 37.22,81.9 U$9.12
EXT3  (via drill 0.3)
  Top 0.128: U2.23 60.4,72.7 v60.3,72.6
  Bottom 0.128: v60.3,72.6 49.2,72.6 40.5,81.3 36,81.3 23.7,93.6 23.7,95.98 U$9.11
EXT4  (via drill 0.3)
  Top 0.128: U2.24 60.65,72.2 v60.3,71.85
  Bottom 0.128: v60.3,71.85 49.05,71.85 40.2,80.7 35.88,80.7 U$9.14
EXT5  (via drill 0.3)
  Top 0.128: U2.25 60.9,71.7 v60.3,71.1
  Bottom 0.128: v60.3,71.1 48.9,71.1 39.9,80.1 34.8,80.1 21,93.9 21,95.82 U$9.13
EXT6  (via drill 0.3)
  Top 0.128: U2.36 75.8,70.75 75.6,70.95 64.8,70.95 63,69.15 v60.3,69.15
  Bottom 0.128: v60.3,69.15 49.05,69.15 39.3,78.9 33.6,78.9 18.6,93.9 18.6,95.96 U$9.15
EXT7  (via drill 0.3)
  Top 0.128: U2.37 76.3,71 76.05,71.25 64.2,71.25 62.85,69.9 v60.3,69.9
  Bottom 0.128: v60.3,69.9 49.2,69.9 39.6,79.5 34.54,79.5 U$9.16
EXT8  (via drill 0.3)
  Top 0.128: U2.76 v82.8,86.4
  Bottom 0.128: v82.8,86.4 82.8,86.7 82.2,87.3 41.98,87.3 U$9.4
EXT9  (via drill 0.3)
  Top 0.128: U2.77 82.3,86.3 v81.9,86.7
  Bottom 0.128: v81.9,86.7 81.75,86.85 40.35,86.85 33.6,93.6 33.6,95.72 U$9.3
EXT10  (via drill 0.3)
  Top 0.128: U2.50 82.8,73.05 81.75,74.1 v81.75,82.65
  Bottom 0.128: v81.75,82.65 81.45,82.95 67.8,82.95 65.7,85.05 37.05,85.05 28.5,93.6 28.5,95.7 U$9.7
EXT11  (via drill 0.3)
  Top 0.128: U2.55 82.9,73.7 82.2,74.4 82.2,81.75 v82.35,81.9
  Bottom 0.128: v82.35,81.9 82.35,82.8 81.75,83.4 68.1,83.4 66,85.5 38.7,85.5 U$9.8
EXT12  (via drill 0.3)
  Top 0.128: U2.56 83.3,74.2 82.5,75 82.5,80.85 v83.1,81.45
  Bottom 0.128: v83.1,81.45 83.1,82.65 81.9,83.85 68.55,83.85 66.45,85.95 39.15,85.95 30.9,94.2 30.9,95.56 U$9.5
EXT13  (via drill 0.3)
  Top 0.128: U2.72 83.1,82.2 82.8,82.5 82.8,83.85 v82.65,84
  Bottom 0.128: v82.65,84 81.45,85.2 69,85.2 67.8,86.4 40.34,86.4 U$9.6
EXT14  (via drill 0.3)
  Top 0.128: U2.99 71.3,86.25 70.7,86.85 65.1,86.85 64.9,86.65 R15.1 64.9,85.4 v63.9,84.4
  Bottom 0.128: v63.9,84.4 63.7,84.6 60.6,84.6 60.4,84.8 50.83,84.8 JP5.1
G  (via drill 0.3)
  Top 0.128: U1.37 31.24,29.96 34.2,27 39.9,27 45.6,21.3 v72.9,21.3 78.9,21.3 83.82,26.22 SCLD1.40 83.82,28.98 v83.7,29.1 | U2.42 78.8,67 81.7,64.05 v81.7,62.7
  Bottom 0.128: v83.7,29.1 83.7,54.6 81.7,56.6 v81.7,62.7 | SOCK2.18 72.86,21.26 v72.9,21.3
GND  (via drill 0.3)
  Top 0.128: U$5.5 89.77,63.92 v89.75,63.9 | R19.1 86.9,89.2 v87,89.1
  Top 0.254: U1.81 35.26,48.7 v34.95,48.4 | U1.62 38.33,41.62 v38,41.95 | U1.11 25.12,43.12 v25.35,43.35 | U1.32 28.75,35.65 v28.95,35.7 | C16.1 v43.7,41.35 | C17.1 v34.8,53.05
  Top 0.305: U1.99 26.24,48.66 v26.45,48.5 | IC1.1 18.35,46.45 v19.2,45.6 v20.1,45.6 v20.1,46.5 v20.1,47.4 | C13.1 v19.55,43.6 | C12.1 v22.2,51.15 | C4.1 v20.89,53.64 v20.9,53.65 | C15.1 v28.2,29.95 | C9.1 v36,23.2 | C10.1 22.5,23.55 v22.55,23.6 | C14.1 v26.75,54.25 | U2.31 v73.3,69 | U2.21 v69.9,73.7 | C23.1 v64.65,81.7 | U2.75 v83.7,83.7 | U2.69 v83.7,80.7 | C19.1 v90.65,74.5 | C18.1 v87.65,70.45 | C24.1 76.5,65.2 v76.8,64.9 | U2.44 v79.8,71.05 | U2.84 v78.8,84.55 | C21.1 v72.65,88.7 | C20.1 v77.65,88.7 | U2.100 70.8,86.2 v70.3,86.2 | C22.1 v66.6,69.4 | U2.62 v83.7,77.2 | R9.2 v3.6,48.95 | R10.2 v93.8,27.3
  Top 0.406: IC2.3 12.96,23.91 v13,23.95 | C6.1 12.1,27.9 v12.05,27.95 | C7.1 v11.75,29.7 | C8.1 17.1,30.5 v17.05,30.55 | USB1.P5 v5.65,30.25 | C99.MINUS 5.27,47.73 v5.25,47.75 | C5.1 6.17,45.17 v6.15,45.15 | C1.1 v94.8,31.25 | C2.1 v96.6,31.3 | SCLD1.18 v63.01,39.59 v63,39.6
  Top 0.61: C26.1 v38.9,67.05 | C25.1 v40,72.15 | IC3.2 v38.1,69.6
  Route2 0.128: v87,89.1 87,89.4
  Route2 0.305: v73.3,69 73.3,69.1 | v64.65,81.7 64.7,81.7 | v83.7,83.7 83.5,83.7 | v83.7,80.7 83.55,80.7 | v90.65,74.5 90.8,74.5 90.9,74.4 | v87.65,70.45 87.65,70.65 87.55,70.75 | v76.8,64.9 76.75,64.95 | v78.8,84.55 78.8,84.5 78.75,84.45 | v72.65,88.7 72.55,88.7 | v77.65,88.7 77.5,88.7 77.45,88.75 | v70.3,86.2 70.1,86.2 | 66.65,69.45 v66.6,69.4 66.55,69.35
  Route2 0.61: v38.9,67.05 39.1,67.05 39.15,67 | v40,72.15 35.05,65.65 35.1,65.6 | v38.1,69.6 38.1,69.45
  Route15 0.305: v69.9,73.7 69.8,73.7
  Bottom 0.254: v25.35,43.35 25.45,43.35 | v28.95,35.7 28.75,35.7 28.7,35.65 | v43.7,41.35 43.35,41.35 | v34.8,53.05 35.1,53.05
  Bottom 0.305: v26.45,48.5 26.35,48.5 | v19.55,43.6 19.75,43.6 | v22.2,51.15 22.35,51.15 | v20.9,53.65 20.55,53.65 | v28.2,29.95 28.2,30.1 28.15,30.15 | v36,23.2 36,22.9 35.9,22.8 | v22.55,23.6 22.55,23.35 22.5,23.3 | v26.75,54.25 26.75,54
  Bottom 0.406: v13,23.95 13.2,23.95 | v12.05,27.95 12.2,27.95 12.25,27.9 | v11.75,29.7 11.9,29.7 12,29.6 | v17.05,30.55 17.05,30.1 | v5.65,30.25 5.95,30.25 | v5.25,47.75 5.45,47.75 5.5,47.8 | v6.15,45.15 6.4,45.15 6.45,45.2 | v94.8,31.25 94.8,32 | v96.6,31.3 96.6,31.25
  other vias: 92.1,36.6 93.4,36.6 92.1,60.3 90.3,60.3 64.2,39.6 63.6,39.6 28.5,43.2 29.4,43.2 30.3,43.2 34.8,45 35.7,45 35.7,44.1 33.9,36 33,36.6 18.9,39.6 20.1,39.6 18.9,36.6 20.1,36.6 17.7,33.9 20.4,32.1 20.4,25.2 20.7,29.4 39.3,49.5 38.4,53.4 39.5,55.3 33.95,53.2 33.05,53 27.15,48.45 38,42.7 29.7,35.75 30.5,35.75 29.25,56.65 38.1,70.5 38.9,67.65 38.9,66.45 38.1,68.7 35,73.05 34.95,71.35 34.95,70.45 34.95,69.55 34.95,68.65 34.95,67.75 34.95,66.85 35.55,66.25 36.45,66.25 37.35,66.25 38.25,66.25 40.35,73.15 41.25,73.15 42.15,73.15 43.05,73.15 43.65,72.55 43.65,71.65 43.65,70.75 43.65,69.85 43.65,68.95
  pour Route2: 0,0 99.9,0 99.9,99.9 0,99.9
  pour Top (rank 2): 44.1,66 34.5,66 34.5,73.5 44.1,73.5
  pour Top (rank 2): 0,99.9 99.9,99.9 99.9,0 0,0
INT  (via drill 0.3)
  Top 0.128: U2.34 74.8,68.75 74.5,68.45 v74.5,66.65 | U1.43 34.24,30.56 36,28.8 43.5,28.8 45.6,26.7 57.6,26.7 58.8,25.5 64.8,25.5 65.7,24.6 73.2,24.6 74.93,26.33 SCLD1.33 74.93,29.03 v75,29.1 75.55,29.65 80,29.65 v80.25,29.4 | R4.1 88.56,20.94 87.3,22.2 v86.4,22.2
  Bottom 0.128: v74.5,66.65 74.5,63.8 76.5,61.8 76.5,30.6 v75,29.1 65.24,19.34 SOCK2.12 | v86.4,22.2 80.4,28.2 80.4,29.25 v80.25,29.4
IORQ  (via drill 0.3)
  Top 0.128: U1.44 34.75,30.65 36.3,29.1 44.1,29.1 45.9,27.3 57.9,27.3 59.1,26.1 64.8,26.1 66,24.9 72.3,24.9 73.66,26.26 SCLD1.32 73.66,28.96 v73.8,29.1 | U2.33 74.3,68.75 73.85,68.3 v73.85,65.9
  Bottom 0.128: v73.85,65.9 73.85,64 75.45,62.4 75.45,59.1 76.2,58.35 76.2,31.5 v73.8,29.1 63.9,19.2 63.9,8.4 62.7,7.2 SOCK2.9
KB0  (via drill 0.3)
  Top 0.128: U1.79 36.25,48.65 36.6,48.3 v37.5,48.3 | v41.4,49.8 44.1,49.8 47.1,52.8 v47.4,52.8 63.3,52.8 64.8,54.3 70.5,54.3 72.39,52.41 SCLD1.5 72.4,51.45 v72.4,50.2 | R3.1 v86.7,58.5 86.7,60 86.4,60.3 v83.7,60.3 | U2.93 v74.3,79.2
  Route15 0.128: v72.39,50.21 v72.4,50.2 80.7,58.5 v86.7,58.5 | SOCK1.16 21.57,9.57 26.4,14.4 35.1,14.4 44.7,24 44.7,27.9 48.9,32.1 48.9,34.3 47.65,35.55 47.65,49.85 47.4,50.1 v47.4,52.8
  Bottom 0.128: v37.5,48.3 39.9,48.3 v41.4,49.8 | v74.3,79.2 77.7,79.2 83.1,73.8 83.1,62.7 83.9,61.9 83.9,60.5 v83.7,60.3
KB1  (via drill 0.3)
  Top 0.128: U1.85 33.25,48.85 v32.7,48.3 | v41.4,51 43.5,51 46.5,54 v47.1,54 63.3,54 64.2,54.9 72.6,54.9 74.93,52.57 SCLD1.3 74.93,50.22 v74.95,50.2 74.95,50.3 | v83.7,57.3 87.7,57.3 R5.1 | U2.91 v75.3,77.4
  Route15 0.128: 75.07,50.32 v74.95,50.2 82.05,57.3 v83.7,57.3
  Bottom 0.128: v41.4,51 36.1,51 33.95,48.85 33.25,48.85 v32.7,48.3 | v75.3,77.4 77.7,77.4 82.2,72.9 82.2,58.2 83.1,57.3 v83.7,57.3 | SOCK1.14 18.98,9.98 23.7,14.7 36,14.7 53.7,32.4 53.7,40.5 46.8,47.4 46.8,53.7 v47.1,54
KB2  (via drill 0.3)
  Top 0.128: U1.84 33.76,48.44 v33.9,48.3 | v42,50.4 43.8,50.4 46.8,53.4 v48,53.4 63.3,53.4 64.5,54.6 72,54.6 73.66,52.94 SCLD1.4 73.66,50.24 v74.7,49.2 | v87,54.9 93.9,54.9 94.2,55.2 94.2,58.5 R6.1 | U2.92 74.8,78.4 v74.4,78 | v85.5,59.7 v83.1,59.7
  Route15 0.128: v74.7,49.2 75.3,49.2 81,54.9 v87,54.9 | SOCK1.13 18.98,7.28 20.4,8.7 20.4,10.2 24.9,14.7 34.8,14.7 44.4,24.3 44.4,28.8 48.3,32.7 48.3,33.5 46.75,35.05 46.75,53.05 47.1,53.4 v48,53.4
  Bottom 0.128: v42,50.4 36,50.4 v33.9,48.3 | v74.4,78 77.7,78 82.5,73.2 82.5,60.3 v83.1,59.7 | v87,54.9 85.8,54.9 85.5,55.2 v85.5,59.7
KB3  (via drill 0.3)
  Top 0.128: U1.96 27.76,48.74 29.1,47.4 v35.4,47.4 | v86.4,56.1 87,55.5 92.7,55.5 93,55.8 93,56.9 R7.1 | v41.7,48.9 44.1,48.9 47.4,52.2 v48,52.2 63.3,52.2 65.1,54 69.9,54 71.12,52.78 SCLD1.6 71.12,49.78 71.7,49.2 v72.6,49.2 | U2.94 v73.8,78.6 | v88.5,60.3 87.8,61 v83.4,61
  Route15 0.128: v86.4,56.1 86.4,56.4 84.9,57.9 81.44,57.9 72.74,49.2 v72.6,49.2 | SOCK1.15 21.73,7.03 22.8,8.1 22.8,9.9 27,14.1 35.4,14.1 45,23.7 45,26.7 49.5,31.2 49.5,35.1 48.55,36.05 48.55,49.55 48,50.1 v48,52.2
  Bottom 0.128: v35.4,47.4 40.2,47.4 v41.7,48.9 | v73.8,78.6 77.7,78.6 82.8,73.5 82.8,61.6 v83.4,61 | v88.5,60.3 88.5,58.2 v86.4,56.1
KB4  (via drill 0.3)
  Top 0.128: U1.26 25.76,27.04 27.6,25.2 38.1,25.2 44.4,18.9 v76.8,18.9 81.6,18.9 87.63,24.93 | R8.1 87.63,24.37 87.63,24.93 | v85.2,63.3 82.5,66 82.5,69 82.3,69.2 U2.49 | 87.63,24.93 SCLD1.43 87.63,28.92 v87.3,29.25
  Bottom 0.128: v85.2,63.3 84.9,63 84.9,55.2 86.7,53.4 86.7,29.7 87.15,29.25 v87.3,29.25 | SOCK2.19 75.43,7.03 76.8,8.4 v76.8,18.9
LED
  Top 0.128: U1.95 28.25,51.15 R11.2
MA0  (via drill 0.3)
  Top 0.128: U2.70 87.8,81.2 v87.9,81.3 | v90.9,45.9 90.86,45.94 SCLD1.57 87.64,45.94 85.75,44.05 64.15,44.05 63.9,43.8 51.6,43.8 47.92,40.12 U1.59
  Route15 0.128: v90.9,45.9 97.5,45.9 98.7,44.7 98.7,15 93.27,9.57 SOCK2.34
  Bottom 0.128: v87.9,81.3 87.9,79.2 88.8,78.3 88.8,73.2 94.8,67.2 94.8,49.8 v90.9,45.9
MA1  (via drill 0.3)
  Top 0.128: U2.65 90.2,78.7 v90.3,78.6 | v90.9,40.8 90.84,40.86 SCLD1.53 88.26,40.86 86.35,38.95 63.55,38.95 62.7,38.1 52.2,38.1 50.7,36.6 v50.1,36.6 | v27,47.1 25.5,47.1 25.03,46.63 U1.4
  Route15 0.128: SOCK2.30 88.1,9.8 89.1,10.8 89.1,19.2 97.5,27.6 97.5,40.5 97.2,40.8 v90.9,40.8
  Bottom 0.128: v90.3,78.6 90.3,77.4 90,77.1 90,74.4 96,68.4 96,45.9 v90.9,40.8 | v50.1,36.6 41.7,36.6 31.2,47.1 v27,47.1
MA2  (via drill 0.3)
  Top 0.128: U2.59 93.7,75.7 v93.9,75.9 | v90.9,35.7 90.82,35.78 SCLD1.49 87.38,35.78 85.5,33.9 57,33.9 56.7,33.6 54.6,33.6 54,33 44.1,33 v43.8,33.3 | v27.3,41.7 26.1,41.7 25.67,42.13 U1.13
  Route15 0.128: SOCK2.25 83.23,7.03 84.3,8.1 84.3,10.2 88.5,14.4 88.5,19.8 96,27.3 96,35.1 95.4,35.7 v90.9,35.7
  Bottom 0.128: v93.9,75.9 93.9,73.2 96.9,70.2 96.9,39.3 93.3,35.7 v90.9,35.7 | v43.8,33.3 43.2,33.9 40.25,33.9 32.45,41.7 v27.3,41.7
MA3  (via drill 0.3)
  Top 0.128: U2.67 88.7,79.7 v89.1,80.1 | v90.9,43.5 90.8,43.4 SCLD1.55 88.1,43.4 86.2,41.5 63.6,41.5 63.5,41.4 51.6,41.4 48.34,38.14 U1.55
  Route15 0.128: SOCK2.32 90.87,9.57 98.1,16.8 98.1,42.9 97.5,43.5 v90.9,43.5
  Bottom 0.128: v89.1,80.1 89.1,79.2 89.4,78.9 89.4,73.8 95.4,67.8 95.4,48 v90.9,43.5
MA4  (via drill 0.3)
  Top 0.128: U1.6 25.16,45.63 25.43,45.9 v27,45.9 | v62.7,36.9 v55.8,36.9 53.4,36.9 52.1,35.6 v48.3,35.6 | U2.11 58,78.7 55.8,76.5 v55.8,62.7 | SCLD1.21 64.22,35.78 v64.2,35.8
  Route15 0.128: SOCK1.32 41.97,9.57 54.3,21.9 54.3,33 55.8,34.5 v55.8,36.9
  Bottom 0.128: v48.3,35.6 41.5,35.6 31.2,45.9 v27,45.9 | v55.8,62.7 v55.8,36.9 | v64.2,35.8 63.8,35.8 v62.7,36.9
MA5  (via drill 0.3)
  Top 0.128: U1.63 48.13,42.13 51,45 v52.8,45 v63.6,45 | U2.6 68.3,81.2 68.1,81 55.8,81 52.8,78 v52.8,63.3 | SCLD1.15 64.35,43.4 v64.3,43.35
  Route15 0.128: SOCK1.26 34.22,9.62 36,11.4 38.1,11.4 52.8,26.1 v52.8,45
  Bottom 0.128: v52.8,63.3 v52.8,45 | v64.3,43.35 64.3,44.3 v63.6,45
MA6  (via drill 0.3)
  Top 0.128: U1.56 48.23,38.62 51.6,42 v53.4,42 64.2,42 64.33,42.13 SCLD1.16 | U2.7 56.4,80.7 53.4,77.7 v53.4,62.7
  Route15 0.128: SOCK1.25 34.33,7.03 35.4,8.1 35.4,10.2 36.3,11.1 38.4,11.1 53.1,25.8 53.1,41.7 v53.4,42
  Bottom 0.128: v53.4,62.7 v53.4,42
MA7  (via drill 0.3)
  Top 0.128: U2.66 89.4,79.2 v89.7,79.5 | v90.9,42.3 90.73,42.13 SCLD1.54 88.33,42.13 86.4,40.2 64.2,40.2 63.55,40.85 51.65,40.85 48.43,37.63 U1.54
  Route15 0.128: SOCK2.29 88.1,7.05 89.35,8.3 89.35,18.85 97.8,27.3 97.8,41.7 97.2,42.3 v90.9,42.3
  Bottom 0.128: v89.7,79.5 89.7,74.1 95.7,68.1 95.7,47.1 v90.9,42.3
MISO
  Top 0.128: U1.22 14.28,37.63 J2.1
MOSI
  Top 0.128: U1.21 14.14,38.14 13.95,37.95 11.92,37.95 J2.4
MREQ  (via drill 0.3)
  Top 0.128: U1.45 35.26,30.75 36.6,29.4 44.7,29.4 46.2,27.9 58.2,27.9 59.4,26.7 64.8,26.7 66.3,25.2 71.4,25.2 72.39,26.19 SCLD1.31 72.39,28.89 v72.6,29.1 | U2.32 73.8,68.7 73.35,68.25 v73.35,63.6
  Bottom 0.128: v73.35,63.6 74.55,62.4 74.55,59.4 75.9,58.05 75.9,32.1 72.9,29.1 v72.6,29.1 62.7,19.2 SOCK2.10
MUX  (via drill 0.3)
  Top 0.128: U1.74 40.74,47.64 40.8,47.7 44.7,47.7 48,51 v49.2,51 v60.6,51 63.3,51 65.6,53.3 67.85,53.3 68.58,52.57 SCLD1.8 | U2.96 72.8,75.5 v71.4,74.1
  Route15 0.128: v68.7,65.4 60.6,57.3 v60.6,51 | SOCK1.17 24.13,7.03 25.2,8.1 25.2,9.9 28.8,13.5 36,13.5 45.6,23.1 45.6,24.3 50.7,29.4 50.7,41.4 49.5,42.6 49.5,49.8 49.2,50.1 v49.2,51
  Bottom 0.128: 71.1,73.8 v71.4,74.1 68.7,71.4 v68.7,65.4
MWR  (via drill 0.3)
  Top 0.128: U2.60 v85.5,76.2 | U1.35 30.25,29.75 33.6,26.4 38.7,26.4 45,20.1 v75.4,20.1 80.7,20.1 86.36,25.76 SCLD1.42 86.36,29.14 v86.1,29.4
  Bottom 0.128: v86.1,29.4 86.1,30.3 86.4,30.6 86.4,53.1 84.6,54.9 84.6,69 85.5,69.9 v85.5,76.2 | SOCK2.20 v75.4,20.1
N$2
  Top 0.406: C8.2 17.1,27.09 IC2.8
N$4
  Top 0.406: USB1.P1 7.05,32.85 7.6,32.83 D1.2
N$5
  Top 0.128: IC2.7 19.18,25.18 19.8,25.8 R12.1
N$6
  Top 0.128: IC2.6 20.32,23.91 21.6,25.2 R13.1
N$7  (via drill 0.3)
  Top 0.128: IC2.4 12.11,22.64 14.35,20.4 16.8,20.4 v18.6,22.2 | v18.6,25.8 18.6,32.2 17.7,33.1 C11.1
  Bottom 0.128: v18.6,22.2 v18.6,25.8
N$20
  Top 0.305: LED2.C 96.45,27.05 R10.1
N$22
  Top 0.305: R11.1 LED3.C
N$58
  Top 0.305: R9.1 LED1.C
NOE  (via drill 0.3)
  Top 0.128: U2.18 68,75.2 v67.8,75 | v49.5,75 v34.5,75 | U1.24 23.08,36.62 v22.8,36.9
  Bottom 0.128: v67.8,75 v49.5,75 | v34.5,75 22.8,63.3 22.8,54.3 20.7,52.2 20.7,42.9 19.2,41.4 19.2,40.8 19.8,40.2 22.2,40.2 22.8,39.6 v22.8,36.9
NRESET  (via drill 0.3)
  Top 0.128: v17.7,36.9 17.7,36 | U1.30 27.76,35.54 27.6,35.7 23.7,35.7 v23.4,35.4 | v21,35.4 18.3,35.4 17.7,36 | C11.2 16.4,34.7 17.7,36 | J2.5 13.26,41.34 15.3,39.3 v17.7,39.3
  Bottom 0.128: v17.7,39.3 v17.7,36.9 | v23.4,35.4 v21,35.4
PWR5
  Top 0.128: R7.2 R6.2 | R5.2 R3.2 R6.2 | R6.2 91.3,61.6 91.5,61.8
  Top 0.305: 92.7,28.8 92.7,24.3 91.2,22.8 R8.2 R4.2 91.1,19.3 86.8,15 86.8,8.25 85.58,7.03 SOCK2.27 | 92.7,28.8 92.7,38.25 | LED2.A 92.7,28.8
  Top 0.406: C2.2 C1.2 94.8,38.1 94.65,38.25
  Top 0.61: Q2.3 34.36,58.96 37.2,61.8 91.5,61.8 95.7,61.8 96.6,60.9 96.6,40.2 94.65,38.25 92.7,38.25 92.63,38.32 SCLD1.51
PWR5EN  (via drill 0.3)
  Top 0.128: Q2.1 28.2,59.91 | 28.2,59.91 26.91,59.91 R14.1 | U1.97 27.25,50.65 27.6,51 27.6,56.4 v28.2,57 | v28.15,60.3 28.2,59.91
  Bottom 0.128: v28.2,57 v28.15,60.3
R  (via drill 0.3)
  Top 0.128: v38.7,31.5 39,31.2 48,31.2 48.6,30.6 60.8,30.6 v61.15,30.25 | U1.25 27.44,36.14 v27.6,36.3 | U2.63 97.2,77.7 v98.4,76.5 | v67.85,30.05 87.55,30.05 88.17,29.43 SCLD1.44 90.87,29.43 v90.9,29.4
  Route15 0.128: SOCK2.22 77.94,9.84 87,18.9 87,21.9 88.2,23.1 88.2,25.8 90.9,28.5 v90.9,29.4
  Bottom 0.128: v27.6,36.3 31.65,36.3 36.45,31.5 v38.7,31.5 | v98.4,76.5 98.4,37.2 90.9,29.7 v90.9,29.4 | v61.15,30.25 61.35,30.05 v67.85,30.05
RAS  (via drill 0.3)
  Top 0.128: U1.27 26.24,27.16 27.9,25.5 38.7,25.5 44.7,19.5 81.3,19.5 v87,25.2 | U2.52 97.6,72.2 v97.8,72 | v88.8,25.2 91.5,27.9 91.5,30 v90.9,30.6 89.44,30.6 SCLD1.45
  Route15 0.128: SOCK2.21 77.94,7.14 79.2,8.4 79.2,10.2 87.3,18.3 87.3,21.6 88.8,23.1 v88.8,25.2
  Bottom 0.128: v97.8,72 98.1,71.7 98.1,37.8 v90.9,30.6 | v87,25.2 v88.8,25.2
RD  (via drill 0.3)
  Top 0.128: SCLD1.24 64.63,31.97 64.5,32.1 v57.6,32.1 41.7,32.1 v41.1,32.4 | U1.16 25.37,40.63 26.1,39.9 v26.7,39.9 | U2.14 59.2,77.2 57.6,75.6 v57.6,63.3
  Route15 0.128: SOCK1.33 44.38,7.18 45.6,8.4 45.6,10.2 55.2,19.8 55.2,29.7 v57.6,32.1
  Bottom 0.128: v41.1,32.4 40.5,33 39.55,33 32.65,39.9 v26.7,39.9 | v57.6,63.3 v57.6,32.1
RDN  (via drill 0.3)
  Top 0.128: SCLD1.61 87.63,52.47 80.7,59.4 v80.39,59.4 v80.4,59.41 v80.4,59.4 80.1,59.7 v45,59.7 41.7,59.7 36.75,54.75 U1.78 | v81.6,72.3 81.15,72.75 81.15,83.25 81.8,83.9 U2.78
  Route15 0.128: v81.6,72.3 81.6,70.8 80.1,69.3 80.1,59.7 v80.4,59.4
  Bottom 0.128: SOCK1.4 6.28,9.88 14.4,18 33.3,18 50.7,35.4 50.7,37.2 43.2,44.7 43.2,57.9 v45,59.7
RFSH  (via drill 0.3)
  Top 0.128: U1.48 36.75,31.05 37.5,30.3 46.5,30.3 47.7,29.1 59.7,29.1 60.6,28.2 65.1,28.2 66.9,26.4 68.4,26.4 68.58,26.58 SCLD1.28 68.58,28.98 v68.7,29.1 | U2.28 71.8,67.1 v71.7,66.9
  Bottom 0.128: v71.7,66.9 71.7,32.1 v68.7,29.1 58.8,19.2 58.8,8.1 57.73,7.03 SOCK2.5
ROMCS  (via drill 0.3)
  Top 0.128: U1.41 33.25,30.35 35.4,28.2 42.3,28.2 44.7,25.8 56.7,25.8 58.2,24.3 64.5,24.3 64.8,24 75,24 77.47,26.47 SCLD1.35 77.47,28.87 v77.7,29.1 | U2.39 77.3,64.4 v77.1,64.2
  Route15 0.128: SOCK2.16 70.32,19.62 77.4,26.7 77.4,28.8 v77.7,29.1
  Bottom 0.128: v77.7,29.1 78.9,29.1 81.3,31.5 81.3,53.1 79.05,55.35 79.05,61.95 77.1,63.9 v77.1,64.2
ROSCS  (via drill 0.3)
  Top 0.128: U1.40 32.74,30.26 35.1,27.9 41.7,27.9 44.4,25.2 56.4,25.2 57.9,23.7 v60.6,23.7 78.6,23.7 81.28,26.38 SCLD1.38 81.28,28.78 v81.6,29.1 | U2.40 77.8,66.2 80.6,63.4 v80.6,62.7
  Bottom 0.128: v81.6,29.1 82.8,30.3 82.8,53.7 79.5,57 79.5,61.6 v80.6,62.7 | SOCK2.3 55.33,7.03 56.4,8.1 56.4,19.5 v60.6,23.7
RXD  (via drill 0.3)
  Top 0.128: U1.2 22.74,47.64 22.2,47.1 v22.2,45.6 | v22.2,42 22.2,40.2 v21.3,39.3 | v21.3,36.9 22.1,36.9 22.5,36.5 22.5,30.9 21.6,30 R13.2
  Bottom 0.128: v22.2,45.6 v22.2,42 | v21.3,39.3 v21.3,36.9
SCK
  Top 0.128: U1.20 13.79,38.62 J2.3
SCLD_CLK  (via drill 0.3)
  Top 0.128: U1.39 32.26,30.14 34.8,27.6 41.1,27.6 45.9,22.8 46.5,22.8 | R2.2 R1.2 47.69,22.8 46.5,22.8 | v46.5,23.7 46.5,22.8 | U2.22 60,73.2 59.4,72.6 v59.4,62.7
  Bottom 0.128: v59.4,62.7 59.4,27.3 55.8,23.7 v46.5,23.7
SW
  Top 0.61: IC3.5 41.9,70.55 U$4.P$1
  pour Top (no thermals): 42.9,70.05 42.9,70.9 38.7,70.9 38.7,70.05
TCK  (via drill 0.3)
  Top 0.128: U$5.4 88.5,66.3 87.6,67.2 84.6,67.2 v83.7,68.1 | v81.6,68.1 81.8,68.2 U2.48 81.8,71.5 81.6,71.7 80.6,71.7 79,73.3 79,75.3 v78.85,75.45 | v60.15,84.3 60.15,86.25 63.9,90 v79.8,90 80.1,90.3 83.1,90.3 84.2,89.2 R19.2
  Route15 0.128: v83.7,68.1 v81.6,68.1
  Bottom 0.128: v78.85,75.45 78.6,75.7 75.2,75.7 72,78.9 66,78.9 v60.15,84.3 | U$8.6 80.01,90.21 v79.8,90
TDI  (via drill 0.3)
  Top 0.128: v81.6,66.3 81,66.3 80.3,67 U2.45 80.3,71.25 79.65,71.9 78.1,71.9 v78,72 | v86.1,63.6 86.4,63.3 87.9,63.3 88.5,63.9 U$5.3 | U$8.10 74.93,92.63 73.5,91.2 63,91.2 | 63,91.2 58.35,86.55 v58.35,84.3 | R16.1 63,91.2
  Route15 0.128: v81.6,66.3 83.4,66.3 v86.1,63.6
  Bottom 0.128: v78,72 78,74.4 77.4,75 74.4,75 71.7,77.7 64.8,77.7 v58.35,84.3
TDO  (via drill 0.3)
  Top 0.128: U$5.6 89.77,67.87 v90.3,68.4 | v91.5,78.9 91.5,81.6 84.9,88.2 81,88.2 | 81,88.2 80.4,88.2 79.3,87.1 U2.83 79.3,87.8 v79.2,87.9 | R17.1 81,88.2
  Route15 0.128: v90.3,68.4 90.3,72.6 91.5,73.8 v91.5,78.9
  Bottom 0.128: U$8.8 77.47,89.63 v79.2,87.9
TMS  (via drill 0.3)
  Top 0.128: U$5.2 87.23,66.37 86.7,66.9 84,66.9 v83.7,67.2 | v81,67.5 81,68.4 81.3,68.7 U2.47 81.3,71.1 81,71.4 80.5,71.4 79.2,72.7 v78.6,72.7 | U$8.4 82.55,92.15 | 82.55,92.15 81,90.6 63.3,90.6 59.25,86.55 v59.25,84.3 | R18.1 84.1,90.6 82.55,92.15
  Route15 0.128: v83.7,67.2 81.3,67.2 v81,67.5
  Bottom 0.128: v78.6,72.7 78.6,74.7 77.95,75.35 74.9,75.35 71.95,78.3 65.4,78.3 v59.25,84.3
TPIN  (via drill 0.3)
  Top 0.128: SCLD1.10 64.15,49.75 63.6,49.2 v50.4,49.2 48.9,49.2 45.82,46.12 U1.71 | U2.1 55.2,83.7 50.4,78.9 v50.4,63.3
  Route15 0.128: SOCK1.19 26.83,7.03 27.9,8.1 27.9,9.9 30.9,12.9 36.6,12.9 51.3,27.6 51.3,42 50.1,43.2 50.1,48.9 v50.4,49.2
  Bottom 0.128: v50.4,63.3 v50.4,49.2
TPOUT  (via drill 0.3)
  Top 0.128: U1.66 46.93,43.63 50.1,46.8 v51,46.8 63.9,46.8 64.31,47.21 SCLD1.12 v66.84,47.21 v66.85,47.2 | v71.4,76.2 v71.4,79.5 | v83.1,79.2 83.1,78.6 83.5,78.2 U2.64
  Route15 0.128: v66.85,47.2 66.85,50.8 v66,51.65 | SOCK1.21 29.23,7.03 30.6,8.4 30.6,10.2 32.7,12.3 37.2,12.3 51.9,27 51.9,42.6 51.3,43.2 51.3,46.5 v51,46.8
  Bottom 0.128: v71.4,79.5 72,80.1 82.2,80.1 v83.1,79.2 | v71.4,76.2 69.9,76.2 66,72.3 v66,51.65
TS  (via drill 0.3)
  Top 0.128: U1.17 25.28,40.12 26.1,39.3 v27.3,39.3 | v40.2,32.1 40.5,31.8 48.6,31.8 49.05,31.35 85.05,31.35 86.94,33.24 SCLD1.47 90.84,33.24 v90.9,33.3 | U2.54 95.1,73.2 v95.4,73.5
  Route15 0.128: SOCK2.23 81.75,8.3 81.75,10.05 87.9,16.2 87.9,20.4 95.4,27.9 95.4,32.7 94.8,33.3 v90.9,33.3
  Bottom 0.128: v40.2,32.1 39.6,32.7 39,32.7 32.4,39.3 v27.3,39.3 | v95.4,73.5 95.4,72.9 97.5,70.8 97.5,38.4 92.4,33.3 v90.9,33.3
TXD  (via drill 0.3)
  Top 0.128: U1.3 23.13,47.13 22.8,46.8 v22.8,44.7 | v22.8,42.6 22.8,39.9 v22.2,39.3 | v21.9,36.3 21.6,36 21.6,31.5 19.8,29.7 R12.2
  Bottom 0.128: v22.8,44.7 v22.8,42.6 | v22.2,39.3 22.2,36.6 v21.9,36.3
V33
  Top 0.256: IC3.4 41.9,68.65
  Top 0.406: C26.2 U$4.P$2
  Top 0.61: 41.9,68.65 U$4.P$2 | L2.1 C26.2
  pour Top (no thermals): 42.8,69.05 42.8,66.6 42.65,66.45 41.4,66.45 41.2,66.65 41.2,69.1 42.75,69.1
WR  (via drill 0.3)
  Top 0.128: U1.8 26.92,44.62 v27,44.7 | v96,69.9 84.3,69.9 83.7,69.3 v83.7,69 | U2.46 v80.8,69 | v90.9,37.2 90.75,37.05 SCLD1.50 87.45,37.05 86.8,36.4 63.8,36.4 62.8,35.4 53.7,35.4 52.9,34.6 v46.5,34.6
  Route15 0.128: v80.8,69 v83.7,69 | SOCK2.28 85.56,9.96 88.8,13.2 88.8,19.5 97.2,27.9 97.2,36.6 96.6,37.2 v90.9,37.2
  Bottom 0.128: v27,44.7 31.2,44.7 41.1,34.8 46.3,34.8 v46.5,34.6 | v96,69.9 96.3,69.9 96.6,69.6 96.6,42.6 91.2,37.2 v90.9,37.2
XT1  (via drill 0.3)
  Top 0.128: R1.1 49.81,22.5 76.2,22.5 v76.5,22.8 | v78,24.3 80.01,26.31 SCLD1.37
  Bottom 0.128: v78,24.3 v76.5,22.8 76.2,22.5 70.8,22.5 69,20.7 69,8.7 67.78,7.48 SOCK2.13
XT2  (via drill 0.3)
  Top 0.128: v75.6,23.1 57.6,23.1 56.4,24.3 R2.1 | SCLD1.36 78.74,26.84 v76.2,24.3
  Bottom 0.128: v76.2,24.3 76.2,23.7 v75.6,23.1 70.8,23.1 67.78,20.08 SOCK2.14
XTAL1  (via drill 0.3)
  Top 0.128: C9.2 32.63,20.8 Q1.2 29.7,23.73 v29.7,24.6 | U1.34 29.74,26.74 v29.7,26.7
  Bottom 0.128: v29.7,26.7 v29.7,24.6
XTAL2  (via drill 0.3)
  Top 0.128: Q1.1 26.91,21.81 | C10.2 26.09,21.1 Q1.1 | U1.33 29.26,27.16 v28.8,26.7 | v28.8,24.6 28.8,23.81 Q1.1
  Bottom 0.128: v28.8,26.7 v28.8,24.6

## Text on the board
tPlace: JTAG | GND | GND | GND | GND | GND | GND | N/C | N/C | N/C | TDI | TDO | TCK | TMS | VREF | GND | GND | Timex TS2068 / Reverse Engineering Board / (C) 2021 Alvaro Lopes | GND | GND | RDN | BDIR | CPUCLKB | A4 | A0 | KB1 | KB0 | BC1 | CSYNC | D0 | D3 | MA5 | D4 | D5 | MA4 | A7RB | A15 | GND | D7 | A13 | AYCLK | MREQ | INT | XT2 | ROMCS | G | MWR | R | CAS1 | CAS2 | WR | MA1 | MA3 | MA0 | D1 | GND | A7 | A6 | A2 | A1 | A3 | KB2 | KB3 | MUX | TPIN | TPOUT | CLK | MA6 | GND | BRHT | CAS | RD | 50/60 | GND | ROSCS | RFSH | A14 | IORQ | BE | XT1 | EXROM | B | KB4 | RAS | TS | MA2 | PWR5 | MA7 | D6 | D2 | A5